# Altium project MotherBoard.PrjPcb (part 1 of 3)
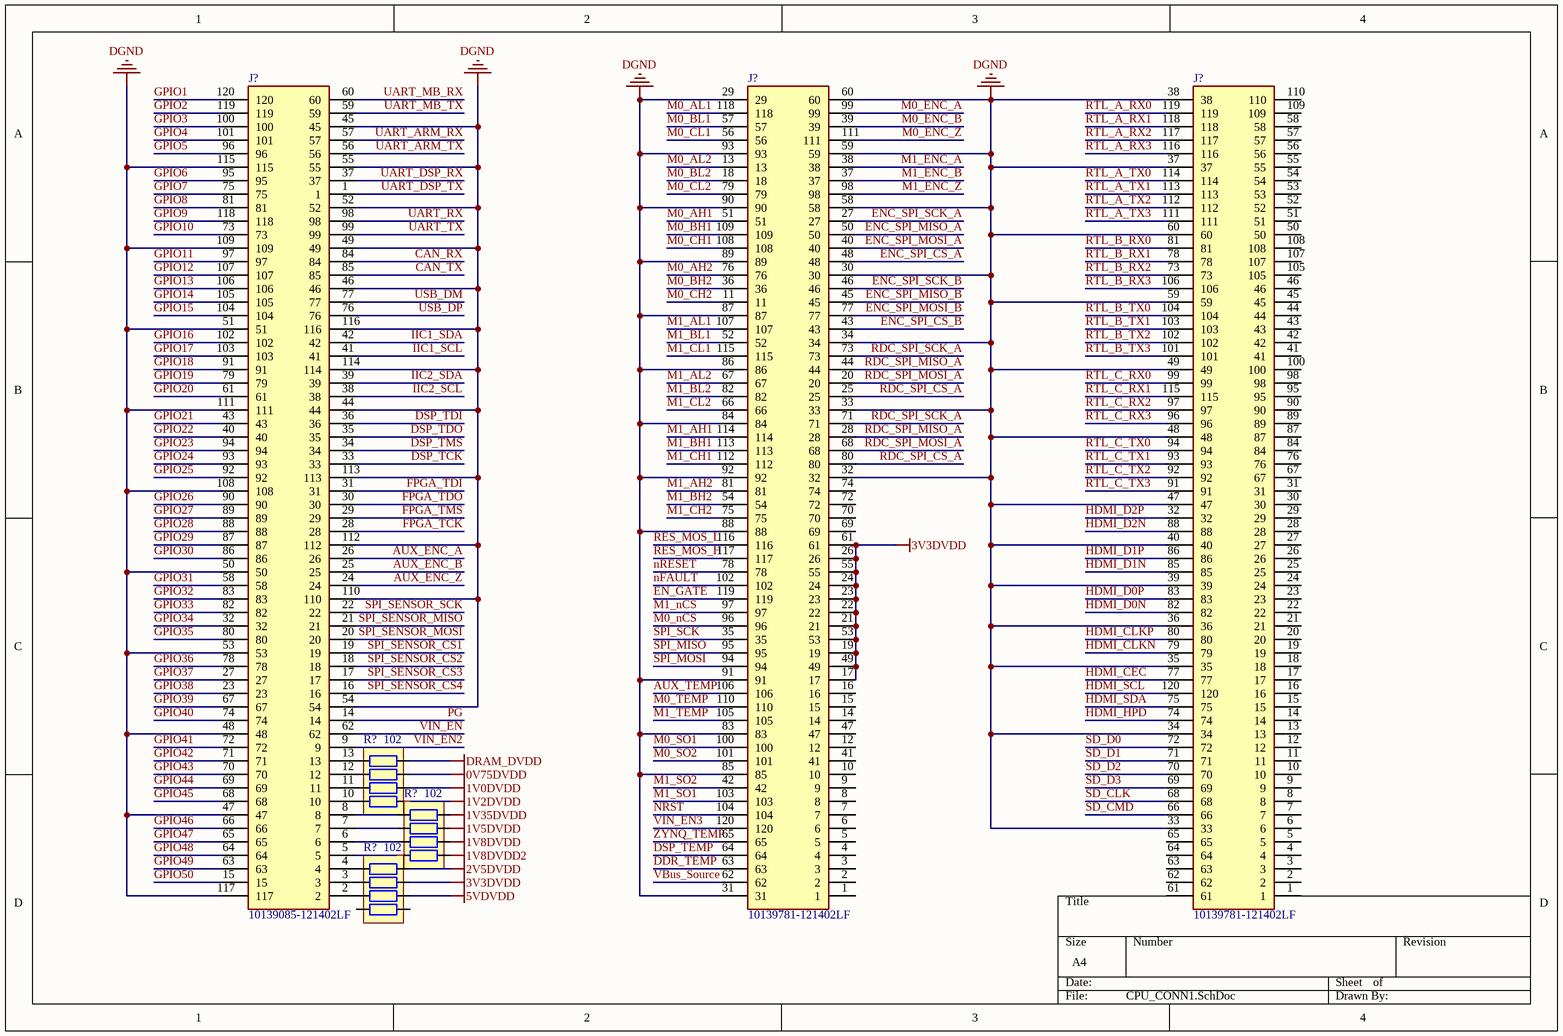
[diagram p0: CPU_CONN1.SchDoc]
15 sheets, 445 parts. Net scope: hierarchical (ports join the sheet entries above them; power ports are global).
Sheets:
  CPU_CONN1.SchDoc
  CPLD.SchDoc
  MainPower.SchDoc
  DigiConn.SchDoc
  PowerBRDConn.SchDoc
  RK3399PRO-JD4.SchDoc
    U_WIFI_BT = WIFI_BT.SchDoc
    U_CODEC = CODEC.SchDoc
    U_HDMI = HDMI.SchDoc
    U_EthernetRTL8211 = EthernetRTL8211.SchDoc
    U_USB_HUB = USB_HUB.SchDoc
    U_STM32F103 = STM32F103.SchDoc
      U_STM32F1Debugger = STM32F1Debugger.SchDoc
      U_PT100 = PT100.SchDoc
        U_PT100_SIG1 = PT100_SIG.SchDoc
        U_PT100_SIG2 = PT100_SIG.SchDoc
        U_PT100_SIG3 = PT100_SIG.SchDoc
        U_PT100_SIG4 = PT100_SIG.SchDoc

## Sheet CPU_CONN1.SchDoc
size A4; SheetNumber: 1; SheetTotal: 16

### Parts
(Parts that share a designator on the sheet are numbered #1, #2 ... from top to bottom, then left to right.)
J?#1  10139085-121402LF  [10139085121402LF]
J?#2  10139781-121402LF  [10139781121402LF]
J?#3  10139781-121402LF  [10139781121402LF]
R?#1  102  [RCA-8P4R-0603]
R?#2  102  [RCA-8P4R-0603]
R?#3  102  [RCA-8P4R-0603]

### Nets
0V75DVDD: R?#1.7
1V0DVDD: R?#1.6
1V2DVDD: R?#1.5
1V5DVDD: R?#2.7
1V8DVDD: R?#2.6
1V8DVDD2: R?#2.5
1V35DVDD: R?#2.8
2V5DVDD: R?#3.8
3V3DVDD: J?#2.17 J?#2.19 J?#2.21 J?#2.22 J?#2.23 J?#2.24 J?#2.26 J?#2.49 J?#2.53 J?#2.55 J?#2.61 R?#3.7
5VDVDD: R?#3.6
DGND: J?#1.44 J?#1.45 J?#1.46 J?#1.47 J?#1.48 J?#1.49 J?#1.50 J?#1.51 J?#1.52 J?#1.53 J?#1.54 J?#1.55 J?#1.108 J?#1.109 J?#1.110 J?#1.111 J?#1.112 J?#1.113 J?#1.114 J?#1.115 J?#1.116 J?#1.117 J?#2.29 J?#2.30 J?#2.31 J?#2.32 J?#2.33 J?#2.34 J?#2.58 J?#2.59 J?#2.60 J?#2.83 J?#2.84 J?#2.85 J?#2.86 J?#2.87 J?#2.88 J?#2.89 J?#2.90 J?#2.91 J?#2.92 J?#2.93 J?#3.33 J?#3.34 J?#3.35 J?#3.36 J?#3.37 J?#3.38 J?#3.39 J?#3.40 J?#3.47 J?#3.48 J?#3.49 J?#3.59 J?#3.60
DRAM_DVDD: R?#1.8
AUX_ENC_A: J?#1.26
AUX_ENC_B: J?#1.25
AUX_ENC_Z: J?#1.24
AUX_TEMP: J?#2.106
CAN_RX: J?#1.84
CAN_TX: J?#1.85
DDR_TEMP: J?#2.63
DSP_TCK: J?#1.33
DSP_TDI: J?#1.36
DSP_TDO: J?#1.35
DSP_TEMP: J?#2.64
DSP_TMS: J?#1.34
EN_GATE: J?#2.119
ENC_SPI_CS_A: J?#2.48
ENC_SPI_CS_B: J?#2.43
ENC_SPI_MISO_A: J?#2.50
ENC_SPI_MISO_B: J?#2.45
ENC_SPI_MOSI_A: J?#2.40
ENC_SPI_MOSI_B: J?#2.77
ENC_SPI_SCK_A: J?#2.27
ENC_SPI_SCK_B: J?#2.46
FPGA_TCK: J?#1.28
FPGA_TDI: J?#1.31
FPGA_TDO: J?#1.30
FPGA_TMS: J?#1.29
GPIO1: J?#1.120
GPIO2: J?#1.119
GPIO3: J?#1.100
GPIO4: J?#1.101
GPIO5: J?#1.96
GPIO6: J?#1.95
GPIO7: J?#1.75
GPIO8: J?#1.81
GPIO9: J?#1.118
GPIO10: J?#1.73
GPIO11: J?#1.97
GPIO12: J?#1.107
GPIO13: J?#1.106
GPIO14: J?#1.105
GPIO15: J?#1.104
GPIO16: J?#1.102
GPIO17: J?#1.103
GPIO18: J?#1.91
GPIO19: J?#1.79
GPIO20: J?#1.61
GPIO21: J?#1.43
GPIO22: J?#1.40
GPIO23: J?#1.94
GPIO24: J?#1.93
GPIO25: J?#1.92
GPIO26: J?#1.90
GPIO27: J?#1.89
GPIO28: J?#1.88
GPIO29: J?#1.87
GPIO30: J?#1.86
GPIO31: J?#1.58
GPIO32: J?#1.83
GPIO33: J?#1.82
GPIO34: J?#1.32
GPIO35: J?#1.80
GPIO36: J?#1.78
GPIO37: J?#1.27
GPIO38: J?#1.23
GPIO39: J?#1.67
GPIO40: J?#1.74
GPIO41: J?#1.72
GPIO42: J?#1.71
GPIO43: J?#1.70
GPIO44: J?#1.69
GPIO45: J?#1.68
GPIO46: J?#1.66
GPIO47: J?#1.65
GPIO48: J?#1.64
GPIO49: J?#1.63
GPIO50: J?#1.15
HDMI_CEC: J?#3.77
HDMI_CLKN: J?#3.79
HDMI_CLKP: J?#3.80
HDMI_D0N: J?#3.82
HDMI_D0P: J?#3.83
HDMI_D1N: J?#3.85
HDMI_D1P: J?#3.86
HDMI_D2N: J?#3.88
HDMI_D2P: J?#3.32
HDMI_HPD: J?#3.74
HDMI_SCL: J?#3.120
HDMI_SDA: J?#3.75
IIC1_SCL: J?#1.41
IIC1_SDA: J?#1.42
IIC2_SCL: J?#1.38
IIC2_SDA: J?#1.39
M0_AH1: J?#2.51
M0_AH2: J?#2.76
M0_AL1: J?#2.118
M0_AL2: J?#2.13
M0_BH1: J?#2.109
M0_BH2: J?#2.36
M0_BL1: J?#2.57
M0_BL2: J?#2.18
M0_CH1: J?#2.108
M0_CH2: J?#2.11
M0_CL1: J?#2.56
M0_CL2: J?#2.79
M0_ENC_A: J?#2.99
M0_ENC_B: J?#2.39
M0_ENC_Z: J?#2.111
M0_nCS: J?#2.96
M0_SO1: J?#2.100
M0_SO2: J?#2.101
M0_TEMP: J?#2.110
M1_AH1: J?#2.114
M1_AH2: J?#2.81
M1_AL1: J?#2.107
M1_AL2: J?#2.67
M1_BH1: J?#2.113
M1_BH2: J?#2.54
M1_BL1: J?#2.52
M1_BL2: J?#2.82
M1_CH1: J?#2.112
M1_CH2: J?#2.75
M1_CL1: J?#2.115
M1_CL2: J?#2.66
M1_ENC_A: J?#2.38
M1_ENC_B: J?#2.37
M1_ENC_Z: J?#2.98
M1_nCS: J?#2.97
M1_SO1: J?#2.103
M1_SO2: J?#2.42
M1_TEMP: J?#2.105
~{NRST}: J?#2.104
nFAULT: J?#2.102
nRESET: J?#2.78
PG: J?#1.14
RDC_SPI_CS_A: J?#2.25 J?#2.80
RDC_SPI_MISO_A: J?#2.28 J?#2.44
RDC_SPI_MOSI_A: J?#2.20 J?#2.68
RDC_SPI_SCK_A: J?#2.71 J?#2.73
RES_MOS_H: J?#2.117
RES_MOS_L: J?#2.116
RTL_A_RX0: J?#3.119
RTL_A_RX1: J?#3.118
RTL_A_RX2: J?#3.117
RTL_A_RX3: J?#3.116
RTL_A_TX0: J?#3.114
RTL_A_TX1: J?#3.113
RTL_A_TX2: J?#3.112
RTL_A_TX3: J?#3.111
RTL_B_RX0: J?#3.81
RTL_B_RX1: J?#3.78
RTL_B_RX2: J?#3.73
RTL_B_RX3: J?#3.106
RTL_B_TX0: J?#3.104
RTL_B_TX1: J?#3.103
RTL_B_TX2: J?#3.102
RTL_B_TX3: J?#3.101
RTL_C_RX0: J?#3.99
RTL_C_RX1: J?#3.115
RTL_C_RX2: J?#3.97
RTL_C_RX3: J?#3.96
RTL_C_TX0: J?#3.94
RTL_C_TX1: J?#3.93
RTL_C_TX2: J?#3.92
RTL_C_TX3: J?#3.91
SD_CLK: J?#3.68
SD_CMD: J?#3.66
SD_D0: J?#3.72
SD_D1: J?#3.71
SD_D2: J?#3.70
SD_D3: J?#3.69
SPI_MISO: J?#2.95
SPI_MOSI: J?#2.94
SPI_SCK: J?#2.35
SPI_SENSOR_CS1: J?#1.19
SPI_SENSOR_CS2: J?#1.18
SPI_SENSOR_CS3: J?#1.17
SPI_SENSOR_CS4: J?#1.16
SPI_SENSOR_MISO: J?#1.21
SPI_SENSOR_MOSI: J?#1.20
SPI_SENSOR_SCK: J?#1.22
UART_ARM_RX: J?#1.57
UART_ARM_TX: J?#1.56
UART_DSP_RX: J?#1.37
UART_DSP_TX: J?#1.1
UART_MB_RX: J?#1.60
UART_MB_TX: J?#1.59
UART_RX: J?#1.98
UART_TX: J?#1.99
USB_DM: J?#1.77
USB_DP: J?#1.76
VBus_Source: J?#2.62
VIN_EN: J?#1.62
VIN_EN2: J?#1.9
VIN_EN3: J?#2.120
ZYNQ_TEMP: J?#2.65
NetJ?#1_2: J?#1.2 R?#3.3
NetJ?#1_3: J?#1.3 R?#3.2
NetJ?#1_4: J?#1.4 R?#3.1
NetJ?#1_5: J?#1.5 R?#2.4
NetJ?#1_6: J?#1.6 R?#2.3
NetJ?#1_7: J?#1.7 R?#2.2
NetJ?#1_8: J?#1.8 R?#2.1
NetJ?#1_10: J?#1.10 R?#1.4
NetJ?#1_11: J?#1.11 R?#1.3
NetJ?#1_12: J?#1.12 R?#1.2
NetJ?#1_13: J?#1.13 R?#1.1

Not connected (* = marked no-connect by the designer): J?#2 1 2 3 4 5 6 7 8 9 10 12 14 15 16 41 47 69 70 72 74; J?#3 1 2 3 4 5 6 7 8 9 10 11 12 13 14 15 16 17 18 19 20 21 22 23 24 25 26 27 28 29 30 31 41 42 43 44 45 46 50 51 52 53 54 55 56 57 58 61 62 63 64 65 67 76 84 87 89 90 95 98 100 105 107 108 109 110; R?#3 4 5

### Library data of the parts
J?#1 = 10139085-121402LF: Connector FE; Manufacturer_Name: Amphenol Communications Solutions; Manufacturer_Part_Number: 10139781-121402LF; Datasheet Link: https://cdn.amphenol-cs.com/media/wysiwyg/files/drawing/10139781.pdf; Height: 4.3mm
J?#2 J?#3 = 10139781-121402LF: Connector M; Manufacturer_Name: Amphenol Communications Solutions; Datasheet Link: https://cdn.amphenol-cs.com/media/wysiwyg/files/drawing/10139781.pdf; Height: 4.3mm; Manufacturer_Part_Number: 10139781-121402LF
R?#1-R?#3 = R-8P4R: 贴片排阻; BOM名称: 贴片网络排阻; 版权归属: 封装库来自淘宝 ID：黄晶宝石; 联系售后: https://shop463601444.taobao.com

## Sheet CPLD.SchDoc
size A4; SheetNumber: 6; SheetTotal: 10
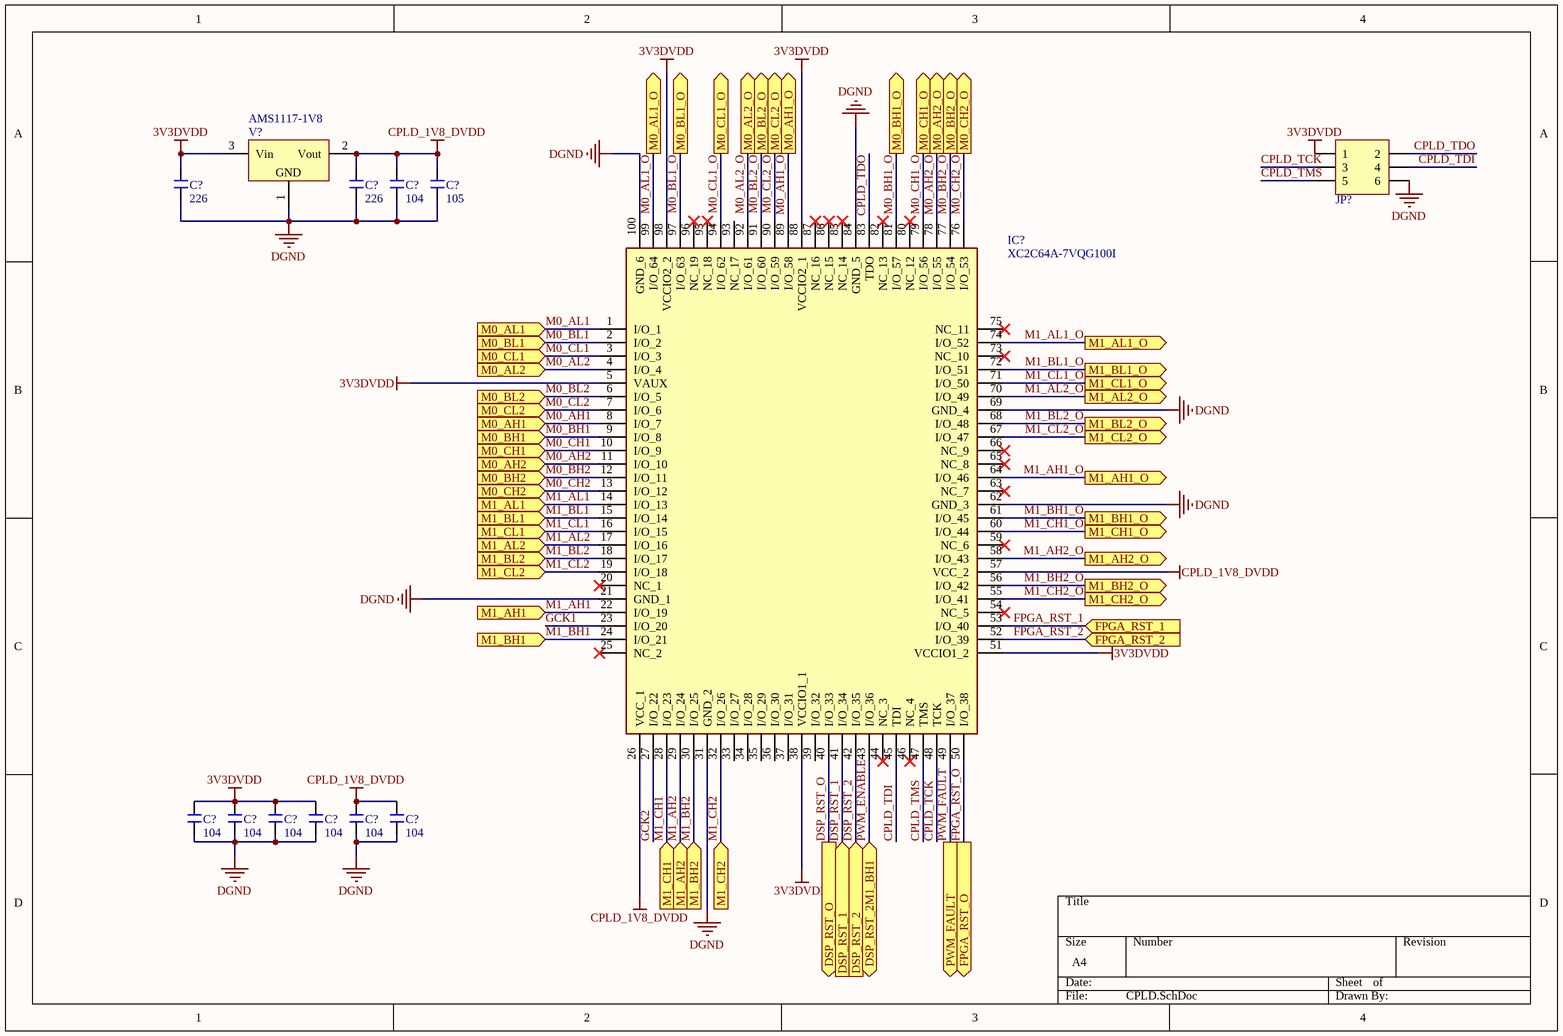
[diagram p1: CPLD.SchDoc]

### Parts
(Parts that share a designator on the sheet are numbered #1, #2 ... from top to bottom, then left to right.)
C?#1  226  [C 1206_L]
C?#2  226  [C 1206_L]
C?#3  104  [C 0603_L]
C?#4  105  [C 0603_L]
C?#5  104  [C 0603_L]
C?#6  104  [C 0603_L]
C?#7  104  [C 0603_L]
C?#8  104  [C 0603_L]
C?#9  104  [C 0603_L]
C?#10  104  [C 0603_L]
IC?#1  XC2C64A-7VQG100I  [QFP50P1600X1600X120-100N]
JP?#1  Header3X2  [IDC2.54-LI-2x3P]  (value not drawn)
V?  AMS1117-1V8  [SOT223_L]

### Ports
DSP_RST_1 (in), DSP_RST_2 (in), DSP_RST_2M1_BH1 (bidir), DSP_RST_O (out), FPGA_RST_1 (in), FPGA_RST_2 (in), FPGA_RST_O (out), M0_AH1 (in), M0_AH1_O (out), M0_AH2 (in), M0_AH2_O (out), M0_AL1 (in), M0_AL1_O (out), M0_AL2 (in), M0_AL2_O (out), M0_BH1 (in), M0_BH1_O (out), M0_BH2 (in), M0_BH2_O (out), M0_BL1 (in), M0_BL1_O (out), M0_BL2 (in), M0_BL2_O (out), M0_CH1 (in), M0_CH1_O (out), M0_CH2 (in), M0_CH2_O (out), M0_CL1 (in), M0_CL1_O (out), M0_CL2 (in), M0_CL2_O (out), M1_AH1 (in), M1_AH1_O (out), M1_AH2 (in), M1_AH2_O (out), M1_AL1 (in), M1_AL1_O (out), M1_AL2 (in), M1_AL2_O (out), M1_BH1 (in), M1_BH1_O (out), M1_BH2 (in), M1_BH2_O (out), M1_BL1 (in), M1_BL1_O (out), M1_BL2 (in), M1_BL2_O (out), M1_CH1 (in), M1_CH1_O (out), M1_CH2 (in), M1_CH2_O (out), M1_CL1 (in), M1_CL1_O (out), M1_CL2 (in), M1_CL2_O (out), PWM_FAULT (out)

### Nets
3V3DVDD: C?#1.2 C?#5.2 C?#6.2 C?#7.2 C?#8.2 IC?#1.5(VAUX) IC?#1.38(VCCIO1_1) IC?#1.51(VCCIO1_2) IC?#1.88(VCCIO2_1) IC?#1.98(VCCIO2_2) JP?#1.1 V?.3(Vin)
CPLD_1V8_DVDD: C?#2.2 C?#3.2 C?#4.2 C?#9.2 C?#10.2 IC?#1.26(VCC_1) IC?#1.57(VCC_2) V?.2(Vout)
DGND: C?#1.1 C?#2.1 C?#3.1 C?#4.1 C?#5.1 C?#6.1 C?#7.1 C?#8.1 C?#9.1 C?#10.1 IC?#1.21(GND_1) IC?#1.31(GND_2) IC?#1.62(GND_3) IC?#1.69(GND_4) IC?#1.84(GND_5) IC?#1.100(GND_6) JP?#1.6 V?.1(GND)
CPLD_TCK: IC?#1.48(TCK) JP?#1.3
CPLD_TDI: IC?#1.45(TDI) JP?#1.4
CPLD_TDO: IC?#1.83(TDO) JP?#1.2
CPLD_TMS: IC?#1.47(TMS) JP?#1.5
DSP_RST_1: IC?#1.41(I/O_34) ; port DSP_RST_1
DSP_RST_2: IC?#1.42(I/O_35) ; port DSP_RST_2
DSP_RST_O: IC?#1.40(I/O_33) ; port DSP_RST_O
FPGA_RST_1: IC?#1.53(I/O_40) ; port FPGA_RST_1
FPGA_RST_2: IC?#1.52(I/O_39) ; port FPGA_RST_2
FPGA_RST_O: IC?#1.50(I/O_38) ; port FPGA_RST_O
GCK1: IC?#1.23(I/O_20)
GCK2: IC?#1.27(I/O_22)
M0_AH1: IC?#1.8(I/O_7) ; port M0_AH1
M0_AH1_O: IC?#1.89(I/O_58) ; port M0_AH1_O
M0_AH2: IC?#1.11(I/O_10) ; port M0_AH2
M0_AH2_O: IC?#1.78(I/O_55) ; port M0_AH2_O
M0_AL1: IC?#1.1(I/O_1) ; port M0_AL1
M0_AL1_O: IC?#1.99(I/O_64) ; port M0_AL1_O
M0_AL2: IC?#1.4(I/O_4) ; port M0_AL2
M0_AL2_O: IC?#1.92(I/O_61) ; port M0_AL2_O
M0_BH1: IC?#1.9(I/O_8) ; port M0_BH1
M0_BH1_O: IC?#1.81(I/O_57) ; port M0_BH1_O
M0_BH2: IC?#1.12(I/O_11) ; port M0_BH2
M0_BH2_O: IC?#1.77(I/O_54) ; port M0_BH2_O
M0_BL1: IC?#1.2(I/O_2) ; port M0_BL1
M0_BL1_O: IC?#1.97(I/O_63) ; port M0_BL1_O
M0_BL2: IC?#1.6(I/O_5) ; port M0_BL2
M0_BL2_O: IC?#1.91(I/O_60) ; port M0_BL2_O
M0_CH1: IC?#1.10(I/O_9) ; port M0_CH1
M0_CH1_O: IC?#1.79(I/O_56) ; port M0_CH1_O
M0_CH2: IC?#1.13(I/O_12) ; port M0_CH2
M0_CH2_O: IC?#1.76(I/O_53) ; port M0_CH2_O
M0_CL1: IC?#1.3(I/O_3) ; port M0_CL1
M0_CL1_O: IC?#1.94(I/O_62) ; port M0_CL1_O
M0_CL2: IC?#1.7(I/O_6) ; port M0_CL2
M0_CL2_O: IC?#1.90(I/O_59) ; port M0_CL2_O
M1_AH1: IC?#1.22(I/O_19) ; port M1_AH1
M1_AH1_O: IC?#1.64(I/O_46) ; port M1_AH1_O
M1_AH2: IC?#1.29(I/O_24) ; port M1_AH2
M1_AH2_O: IC?#1.58(I/O_43) ; port M1_AH2_O
M1_AL1: IC?#1.14(I/O_13) ; port M1_AL1
M1_AL1_O: IC?#1.74(I/O_52) ; port M1_AL1_O
M1_AL2: IC?#1.17(I/O_16) ; port M1_AL2
M1_AL2_O: IC?#1.70(I/O_49) ; port M1_AL2_O
M1_BH1: IC?#1.24(I/O_21) ; port M1_BH1
M1_BH1_O: IC?#1.61(I/O_45) ; port M1_BH1_O
M1_BH2: IC?#1.30(I/O_25) ; port M1_BH2
M1_BH2_O: IC?#1.56(I/O_42) ; port M1_BH2_O
M1_BL1: IC?#1.15(I/O_14) ; port M1_BL1
M1_BL1_O: IC?#1.72(I/O_51) ; port M1_BL1_O
M1_BL2: IC?#1.18(I/O_17) ; port M1_BL2
M1_BL2_O: IC?#1.68(I/O_48) ; port M1_BL2_O
M1_CH1: IC?#1.28(I/O_23) ; port M1_CH1
M1_CH1_O: IC?#1.60(I/O_44) ; port M1_CH1_O
M1_CH2: IC?#1.32(I/O_26) ; port M1_CH2
M1_CH2_O: IC?#1.55(I/O_41) ; port M1_CH2_O
M1_CL1: IC?#1.16(I/O_15) ; port M1_CL1
M1_CL1_O: IC?#1.71(I/O_50) ; port M1_CL1_O
M1_CL2: IC?#1.19(I/O_18) ; port M1_CL2
M1_CL2_O: IC?#1.67(I/O_47) ; port M1_CL2_O
PWM_ENABLE: IC?#1.43(I/O_36) ; port DSP_RST_2M1_BH1
PWM_FAULT: IC?#1.49(I/O_37) ; port PWM_FAULT

Not connected (* = marked no-connect by the designer): IC?#1 20(NC_1)* 25(NC_2)* 33(I/O_27) 34(I/O_28) 35(I/O_29) 36(I/O_30) 37(I/O_31) 39(I/O_32) 44(NC_3)* 46(NC_4)* 54(NC_5)* 59(NC_6)* 63(NC_7)* 65(NC_8)* 66(NC_9)* 73(NC_10)* 75(NC_11)* 80(NC_12)* 82(NC_13)* 85(NC_14)* 86(NC_15)* 87(NC_16)* 93(NC_17) 95(NC_18)* 96(NC_19)*

### Library data of the parts
C?#1-C?#10 = C: 贴片电容; BOM名称: 无极性贴片电容
IC?#1 = XC2C64A-7VQG100I: Integrated Circuit; Manufacturer_Name: XILINX; Datasheet Link: https://docs.xilinx.com/v/u/en-US/ds311; Height: 1.2mm; Manufacturer_Part_Number: XC2C64A-7VQG100I; Mouser Part Number: 217-XC2C64A-7VQG100I; Mouser Price/Stock: https://www.mouser.co.uk/ProductDetail/Xilinx/XC2C64A-7VQG100I?qs=rrS6PyfT74c4zVdxhv%2F4jw%3D%3D
JP?#1 = Header 3X2: 3*2P接插件; 版权归属: 封装库来自淘宝 ID：黄晶宝石; BOM名称: 3*2P接插件; 学习资源: https://shop463601444.taobao.com
V? = AMS1117: 三端稳压芯片; BOM名称: 稳压芯片

## Sheet MainPower.SchDoc
size A4; SheetNumber: 7; SheetTotal: 16
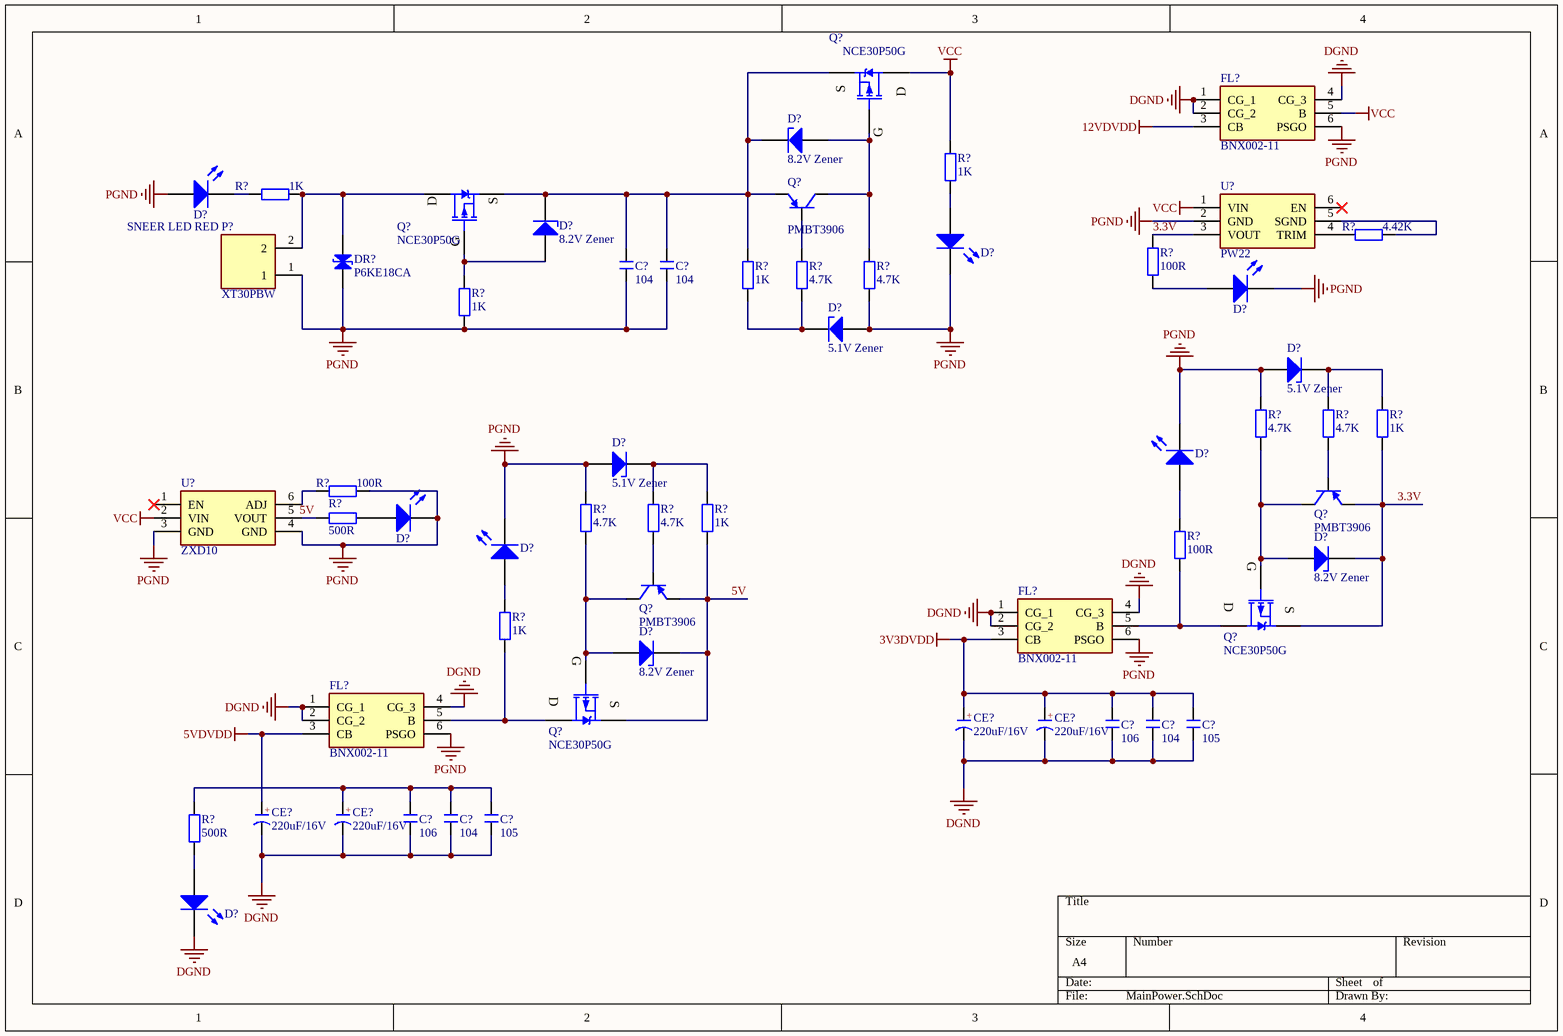
[diagram p2: MainPower.SchDoc]

### Parts
(Parts that share a designator on the sheet are numbered #1, #2 ... from top to bottom, then left to right.)
C?#11  104  [C 0603_L]
C?#12  104  [C 0603_L]
C?#13  106  [C 0603_L]
C?#14  104  [C 0603_L]
C?#15  105  [C 0603_L]
C?#16  106  [C 0603_L]
C?#17  104  [C 0603_L]
C?#18  105  [C 0603_L]
CE?#1  220uF/16V  [CAP 1.5*4*8]
CE?#2  220uF/16V  [CAP 1.5*4*8]
CE?#3  220uF/16V  [CAP 1.5*4*8]
CE?#4  220uF/16V  [CAP 1.5*4*8]
D?#1  8.2V Zener  [DIODE-1206]
D?#2  LED  [LED 0603W]  (value not drawn)
D?#3  8.2V Zener  [DIODE-1206]
D?#4  LED  [LED 0603W]  (value not drawn)
D?#5  LED  [LED 0603W]  (value not drawn)
D?#6  5.1V Zener  [DIODE-1206]
D?#7  5.1V Zener  [DIODE-1206]
D?#8  5.1V Zener  [DIODE-1206]
D?#9  LED  [LED 0603W]  (value not drawn)
D?#10  LED  [LED 0603W]  (value not drawn)
D?#11  LED  [LED 0603W]  (value not drawn)
D?#12  8.2V Zener  [DIODE-1206]
D?#13  8.2V Zener  [DIODE-1206]
D?#14  LED  [LED 0603W]  (value not drawn)
DR?  P6KE18CA  [SMA]
FL?#1  BNX002-11  [BNX00211]
FL?#2  BNX002-11  [BNX00211]
FL?#3  BNX002-11  [BNX00211]
P?  XT30PBW  [XT60]
Q?#1  NCE30P50G  [DFN 5X6]
Q?#2  PMBT3906  [SOT23-3N]
Q?#3  NCE30P50G  [DFN 5X6]
Q?#4  PMBT3906  [SOT23-3N]
Q?#5  NCE30P50G  [DFN 5X6]
Q?#6  PMBT3906  [SOT23-3N]
Q?#7  NCE30P50G  [DFN 5X6]
R?#4  1K  [R 0603_L]
R?#5  1K  [R 0603_L]
R?#6  100R  [R 0603_L]
R?#7  4.42K  [R 0603_L]
R?#8  1K  [R 0603_L]
R?#9  4.7K  [R 0603_L]
R?#10  4.7K  [R 0603_L]
R?#11  1K  [R 0603_L]
R?#12  4.7K  [R 0603_L]
R?#13  4.7K  [R 0603_L]
R?#14  1K  [R 0603_L]
R?#15  100R  [R 0603_L]
R?#16  4.7K  [R 0603_L]
R?#17  500R  [R 0603_L]
R?#18  4.7K  [R 0603_L]
R?#19  1K  [R 0603_L]
R?#20  100R  [R 0603_L]
R?#21  1K  [R 0603_L]
R?#22  500R  [R 0603_L]
U?#1  PW22  [PW22]
U?#2  ZXD10  [ZXD10]

### Nets
3V3DVDD: C?#13.2 C?#14.2 C?#15.2 CE?#1.1(A) CE?#2.1(A) FL?#2.3(CB)
5VDVDD: CE?#3.1(A) FL?#3.3(CB)
12VDVDD: FL?#1.3(CB)
DGND: C?#13.1 C?#14.1 C?#15.1 C?#16.1 C?#17.1 C?#18.1 CE?#1.2(K) CE?#2.2(K) CE?#3.2(K) CE?#4.2(K) D?#14.2(K) FL?#1.1(CG_1) FL?#1.2(CG_2) FL?#1.4(CG_3) FL?#2.1(CG_1) FL?#2.2(CG_2) FL?#2.4(CG_3) FL?#3.1(CG_1) FL?#3.2(CG_2) FL?#3.4(CG_3)
PGND: C?#11.1 C?#12.1 D?#2.1(A) D?#4.2(K) D?#5.2(K) D?#6.1(A) D?#7.1(A) D?#8.1(A) D?#9.2(K) D?#10.2(K) D?#11.2(K) DR?.1(A) FL?#1.6(PSGO) FL?#2.6(PSGO) FL?#3.6(PSGO) P?.1 R?#10.1 R?#11.1 R?#12.1 R?#15.1 R?#16.1 U?#1.2(GND) U?#2.3(GND) U?#2.4(GND)
VCC: FL?#1.5(B) Q?#1.2(D) R?#4.1 U?#1.1(VIN) U?#2.2(VIN)
3.3V: D?#12.2(K) Q?#4.2(E) Q?#5.3(S) R?#6.1 R?#14.1 U?#1.3(VOUT)
5V: D?#13.2(K) Q?#6.2(E) Q?#7.3(S) R?#17.1 R?#19.1 U?#2.5(VOUT)
NetC?#11_2: C?#11.2 C?#12.2 D?#1.2(K) D?#3.2(K) Q?#1.3(S) Q?#2.2(E) Q?#3.3(S) R?#8.1
NetC?#16_2: C?#16.2 C?#17.2 C?#18.2 CE?#4.1(A) R?#22.1
NetD?#1_1: D?#1.1(A) Q?#1.1(G) Q?#2.3(C) R?#10.2
NetD?#2_2: D?#2.2(K) R?#5.2
NetD?#3_1: D?#3.1(A) Q?#3.1(G) R?#11.2
NetD?#4_1: D?#4.1(A) R?#4.2
NetD?#5_1: D?#5.1(A) R?#6.2
NetD?#6_2: D?#6.2(K) R?#8.2 R?#9.2
NetD?#7_2: D?#7.2(K) R?#13.2 R?#14.2
NetD?#8_2: D?#8.2(K) R?#18.2 R?#19.2
NetD?#9_1: D?#9.1(A) R?#20.2
NetD?#10_1: D?#10.1(A) R?#17.2
NetD?#11_1: D?#11.1(A) R?#21.2
NetD?#12_1: D?#12.1(A) Q?#4.3(C) Q?#5.1(G) R?#12.2
NetD?#13_1: D?#13.1(A) Q?#6.3(C) Q?#7.1(G) R?#16.2
NetD?#14_1: D?#14.1(A) R?#22.2
NetDR?_2: DR?.2(K) P?.2 Q?#3.2(D) R?#5.1
NetFL?#2_5: FL?#2.5(B) Q?#5.2(D) R?#20.1
NetFL?#3_5: FL?#3.5(B) Q?#7.2(D) R?#21.1
NetQ?#2_1: Q?#2.1(B) R?#9.1
NetQ?#4_1: Q?#4.1(B) R?#13.1
NetQ?#6_1: Q?#6.1(B) R?#18.1
NetR?#7_1: R?#7.1 U?#1.5(SGND)
NetR?#7_2: R?#7.2 U?#1.4(TRIM)
NetR?#15_2: R?#15.2 U?#2.6(ADJ)

Not connected (* = marked no-connect by the designer): U?#1 6(EN)*; U?#2 1(EN)*

### Notes on the sheet
- (near D?#2) SNEER LED RED
- (in symbol CE) +

### Library data of the parts
C?#11-C?#18 = C: 贴片电容; BOM名称: 无极性贴片电容; 淘宝ID: 封装库来自淘宝 ID：黄晶宝石; 联系售后，技术支持: https://shop463601444.taobao.com; 唯一出售店铺网址: https://shop463601444.taobao.com
CE?#1-CE?#4 = CE: 直插电解电容; 淘宝ID: 封装库来自淘宝 ID：黄晶宝石; BOM名称: 直插电解电容; 联系售后: https://shop463601444.taobao.com
D?#1 D?#3 D?#6-D?#8 D?#12 D?#13 = 稳压二极管: Zener Diode
D?#2 D?#4 D?#5 D?#9-D?#11 D?#14 = LED: 发光二极管
  D?#2 D?#5 D?#9-D?#11 D?#14: 技术支持，联系售后: https://shop463601444.taobao.com
DR? = DR: 瞬态电压抑制二极管; 版权归属: 封装库来自淘宝 ID：黄晶宝石; BOM名称: 瞬态电压抑制二极管; 学习资源: https://shop463601444.taobao.com
FL?#1-FL?#3 = BNX002-11: Filter; Manufacturer_Name: Murata Electronics; Datasheet Link: https://componentsearchengine.com//BNX002-11.pdf; Height: 12.5mm; Mouser2 Part Number: 81-BNX002-11; Mouser2 Price/Stock: https://www.mouser.com/Search/Refine.aspx?Keyword=81-BNX002-11; Manufacturer_Part_Number: BNX002-11
P? = XT60PBW
Q?#1 Q?#3 Q?#5 Q?#7 = IRF4905: P沟场效应管; BOM名称: P沟场效应管
Q?#2 Q?#4 Q?#6 = 8550-SMD: 高频放大-PNP型; 属性: 40V 1.5A 1W 100MHZ
R?#4-R?#22 = R: 贴片电阻

## Sheet DigiConn.SchDoc
size A4; SheetNumber: 11; SheetTotal: 11
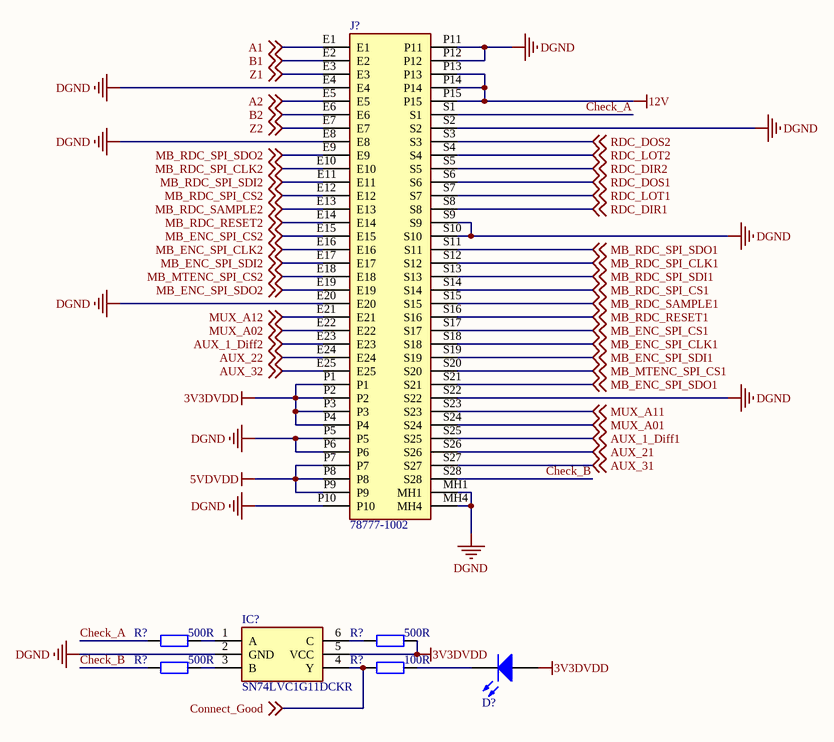
[diagram p3: DigiConn.SchDoc]

### Parts
(Parts that share a designator on the sheet are numbered #1, #2 ... from top to bottom, then left to right.)
D?#15  LED  [LED_A2]  (value not drawn)
IC?#2  SN74LVC1G11DCKR  [SOT65P210X110-6N]
J?#4  78777-1002  [787771002]
R?#23  500R  [R 0603_L]
R?#24  500R  [R 0603_L]
R?#25  500R  [R 0603_L]
R?#26  100R  [R 0603_L]

### Nets
3V3DVDD: D?#15.1(A) IC?#2.5(VCC) J?#4.P1 J?#4.P2 J?#4.P3 J?#4.P4 R?#24.1
5VDVDD: J?#4.P7 J?#4.P8 J?#4.P9
12V: J?#4.P13 J?#4.P14 J?#4.P15
DGND: IC?#2.2(GND) J?#4.E4 J?#4.E8 J?#4.E20 J?#4.MH1 J?#4.MH4 J?#4.P5 J?#4.P6 J?#4.P10 J?#4.P11 J?#4.P12 J?#4.S2 J?#4.S9 J?#4.S10 J?#4.S22
A1: J?#4.E1 ; off-sheet A1
A2: J?#4.E5 ; off-sheet A2
AUX_1_Diff1: J?#4.S25 ; off-sheet AUX_1_Diff1
AUX_1_Diff2: J?#4.E23 ; off-sheet AUX_1_Diff2
AUX_21: J?#4.S26 ; off-sheet AUX_21
AUX_22: J?#4.E24 ; off-sheet AUX_22
AUX_31: J?#4.S27 ; off-sheet AUX_31
AUX_32: J?#4.E25 ; off-sheet AUX_32
B1: J?#4.E2 ; off-sheet B1
B2: J?#4.E6 ; off-sheet B2
Check_A: J?#4.S1 R?#23.2
Check_B: J?#4.S28 R?#25.2
Connect_Good: IC?#2.4(Y) R?#26.2 ; off-sheet Connect_Good
MB_ENC_SPI_CLK1: J?#4.S18 ; off-sheet MB_ENC_SPI_CLK1
MB_ENC_SPI_CLK2: J?#4.E16 ; off-sheet MB_ENC_SPI_CLK2
MB_ENC_SPI_CS1: J?#4.S17 ; off-sheet MB_ENC_SPI_CS1
MB_ENC_SPI_CS2: J?#4.E15 ; off-sheet MB_ENC_SPI_CS2
MB_ENC_SPI_SDI1: J?#4.S19 ; off-sheet MB_ENC_SPI_SDI1
MB_ENC_SPI_SDI2: J?#4.E17 ; off-sheet MB_ENC_SPI_SDI2
MB_ENC_SPI_SDO1: J?#4.S21 ; off-sheet MB_ENC_SPI_SDO1
MB_ENC_SPI_SDO2: J?#4.E19 ; off-sheet MB_ENC_SPI_SDO2
MB_MTENC_SPI_CS1: J?#4.S20 ; off-sheet MB_MTENC_SPI_CS1
MB_MTENC_SPI_CS2: J?#4.E18 ; off-sheet MB_MTENC_SPI_CS2
MB_RDC_RESET1: J?#4.S16 ; off-sheet MB_RDC_RESET1
MB_RDC_RESET2: J?#4.E14 ; off-sheet MB_RDC_RESET2
MB_RDC_SAMPLE1: J?#4.S15 ; off-sheet MB_RDC_SAMPLE1
MB_RDC_SAMPLE2: J?#4.E13 ; off-sheet MB_RDC_SAMPLE2
MB_RDC_SPI_CLK1: J?#4.S12 ; off-sheet MB_RDC_SPI_CLK1
MB_RDC_SPI_CLK2: J?#4.E10 ; off-sheet MB_RDC_SPI_CLK2
MB_RDC_SPI_CS1: J?#4.S14 ; off-sheet MB_RDC_SPI_CS1
MB_RDC_SPI_CS2: J?#4.E12 ; off-sheet MB_RDC_SPI_CS2
MB_RDC_SPI_SDI1: J?#4.S13 ; off-sheet MB_RDC_SPI_SDI1
MB_RDC_SPI_SDI2: J?#4.E11 ; off-sheet MB_RDC_SPI_SDI2
MB_RDC_SPI_SDO1: J?#4.S11 ; off-sheet MB_RDC_SPI_SDO1
MB_RDC_SPI_SDO2: J?#4.E9 ; off-sheet MB_RDC_SPI_SDO2
MUX_A01: J?#4.S24 ; off-sheet MUX_A01
MUX_A02: J?#4.E22 ; off-sheet MUX_A02
MUX_A11: J?#4.S23 ; off-sheet MUX_A11
MUX_A12: J?#4.E21 ; off-sheet MUX_A12
RDC_DIR1: J?#4.S8 ; off-sheet RDC_DIR1
RDC_DIR2: J?#4.S5 ; off-sheet RDC_DIR2
RDC_DOS1: J?#4.S6 ; off-sheet RDC_DOS1
RDC_DOS2: J?#4.S3 ; off-sheet RDC_DOS2
RDC_LOT1: J?#4.S7 ; off-sheet RDC_LOT1
RDC_LOT2: J?#4.S4 ; off-sheet RDC_LOT2
Z1: J?#4.E3 ; off-sheet Z1
Z2: J?#4.E7 ; off-sheet Z2
NetD?#15_2: D?#15.2(K) R?#26.1
NetIC?#2_1: IC?#2.1(A) R?#23.1
NetIC?#2_3: IC?#2.3(B) R?#25.1
NetIC?#2_6: IC?#2.6(C) R?#24.2

### Library data of the parts
D?#15 = LED: 发光二极管; 技术支持，联系售后: https://shop463601444.taobao.com
IC?#2 = SN74LVC1G11DCKR: Integrated Circuit; Manufacturer_Name: Texas Instruments; Datasheet Link: http://componentsearchengine.com/Datasheets/1/SN74LVC1G11DCKR.pdf; Height: 1.1mm; Manufacturer_Part_Number: SN74LVC1G11DCKR; Mouser Part Number: 595-SN74LVC1G11DCKR; Mouser Price/Stock: https://www.mouser.co.uk/ProductDetail/Texas-Instruments/SN74LVC1G11DCKR?qs=nqigI8dpoHIKzrNU0QT3Ag%3D%3D; Arrow Part Number: SN74LVC1G11DCKR; Arrow Price/Stock: https://www.arrow.com/en/products/sn74lvc1g11dckr/texas-instruments?region=nac
J?#4 = 78777-1002: Connector; Manufacturer_Name: Molex; Datasheet Link: https://www.molex.com/pdm_docs/sd/787771002_sd.pdf; Height: 10.03mm; Manufacturer_Part_Number: 78777-1002; Mouser Part Number: 538-78777-1002; Mouser Price/Stock: https://www.mouser.co.uk/ProductDetail/Molex/78777-1002?qs=PQDAUpz3sUPC2Og%2FkFefJw%3D%3D
R?#23-R?#26 = R: 贴片电阻; 版权归属: 来自淘宝 ID：黄晶宝石; 封装库来自淘宝卖家 ID：黄晶宝石: 其他店铺购入均为盗版，不享受售后技术支持服务，请立即申请退款; BOM名称: 贴片电阻; 联系售后: https://shop463601444.taobao.com

## Sheet PowerBRDConn.SchDoc
size A4; SheetNumber: 10; SheetTotal: 10
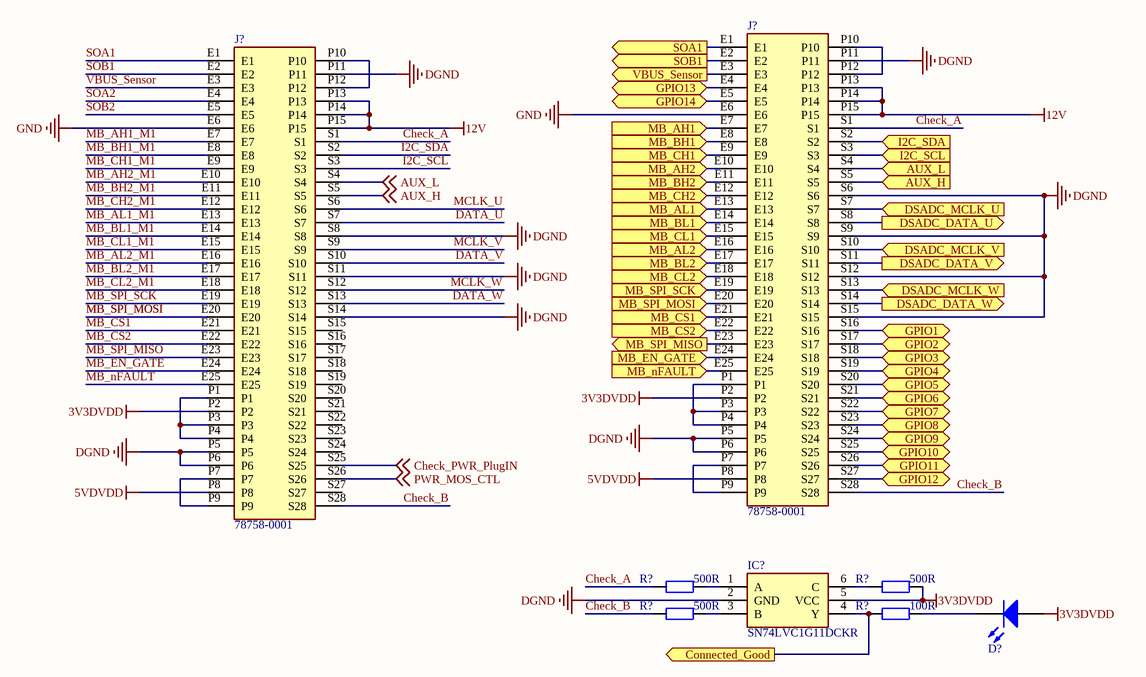
[diagram p4: PowerBRDConn.SchDoc]

### Parts
(Parts that share a designator on the sheet are numbered #1, #2 ... from top to bottom, then left to right.)
D?#16  LED  [LED_A2]  (value not drawn)
IC?#3  SN74LVC1G11DCKR  [SOT65P210X110-6N]
J?#5  78758-0001  [78758-0001]
J?#6  78758-0001  [78758-0001]
R?#27  500R  [R 0603_L]
R?#28  500R  [R 0603_L]
R?#29  500R  [R 0603_L]
R?#30  100R  [R 0603_L]

### Ports
AUX_H (in), AUX_L (in), Connected_Good (out), DSADC_DATA_U (out), DSADC_DATA_V (out), DSADC_DATA_W (out), DSADC_MCLK_U (in), DSADC_MCLK_V (in), DSADC_MCLK_W (in), GPIO1 (bidir), GPIO2 (bidir), GPIO3 (bidir), GPIO4 (bidir), GPIO5 (bidir), GPIO6 (bidir), GPIO7 (bidir), GPIO8 (bidir), GPIO9 (bidir), GPIO10 (bidir), GPIO11 (bidir), GPIO12 (bidir), GPIO13 (bidir), GPIO14 (bidir), I2C_SCL (in), I2C_SDA (in), MB_AH1 (in), MB_AH2 (in), MB_AL1 (in), MB_AL2 (in), MB_BH1 (in), MB_BH2 (in), MB_BL1 (in), MB_BL2 (in), MB_CH1 (in), MB_CH2 (in), MB_CL1 (in), MB_CL2 (in), MB_CS1 (in), MB_CS2 (in), MB_EN_GATE (in), MB_nFAULT (in), MB_SPI_MISO (out), MB_SPI_MOSI (in), MB_SPI_SCK (in), SOA1 (out), SOB1 (out), VBUS_Sensor (out)

### Nets
3V3DVDD: D?#16.1(A) IC?#3.5(VCC) J?#5.P2 J?#6.P2 R?#28.1
5VDVDD: J?#5.P8 J?#6.P8
12V: J?#5.P13 J?#5.P14 J?#5.P15 J?#6.P13 J?#6.P14 J?#6.P15
DGND: IC?#3.2(GND) J?#5.P5 J?#5.P6 J?#5.P11 J?#5.S6 J?#5.S9 J?#5.S12 J?#5.S15 J?#6.P5 J?#6.P6 J?#6.P11 J?#6.S8 J?#6.S11 J?#6.S14
GND: J?#5.E6 J?#6.E6
AUX_H: J?#6.S5 ; off-sheet AUX_H
AUX_L: J?#6.S4 ; off-sheet AUX_L
Check_A: J?#5.S1 J?#6.S1 R?#27.2
Check_B: J?#5.S28 J?#6.S28 R?#29.2
Check_PWR_PlugIN: J?#6.S25 ; off-sheet Check_PWR_PlugIN
DATA_U: J?#6.S7
DATA_V: J?#6.S10
DATA_W: J?#6.S13
I2C_SCL: J?#6.S3
I2C_SDA: J?#6.S2
MB_AH1_M1: J?#6.E7
MB_AH2_M1: J?#6.E10
MB_AL1_M1: J?#6.E13
MB_AL2_M1: J?#6.E16
MB_BH1_M1: J?#6.E8
MB_BH2_M1: J?#6.E11
MB_BL1_M1: J?#6.E14
MB_BL2_M1: J?#6.E17
MB_CH1_M1: J?#6.E9
MB_CH2_M1: J?#6.E12
MB_CL1_M1: J?#6.E15
MB_CL2_M1: J?#6.E18
MB_CS1: J?#6.E21
MB_CS2: J?#6.E22
MB_EN_GATE: J?#6.E24
MB_nFAULT: J?#6.E25
MB_SPI_MISO: J?#6.E23
MB_SPI_MOSI: J?#6.E20
MB_SPI_SCK: J?#6.E19
MCLK_U: J?#6.S6
MCLK_V: J?#6.S9
MCLK_W: J?#6.S12
PWR_MOS_CTL: J?#6.S26 ; off-sheet PWR_MOS_CTL
SOA1: J?#6.E1
SOA2: J?#6.E4
SOB1: J?#6.E2
SOB2: J?#6.E5
VBUS_Sensor: J?#6.E3
NetD?#16_2: D?#16.2(K) R?#30.1
NetIC?#3_1: IC?#3.1(A) R?#27.1
NetIC?#3_3: IC?#3.3(B) R?#29.1
NetIC?#3_4: IC?#3.4(Y) R?#30.2 ; port Connected_Good
NetIC?#3_6: IC?#3.6(C) R?#28.2
NetJ?#5_E1: J?#5.E1 ; port SOA1
NetJ?#5_E2: J?#5.E2 ; port SOB1
NetJ?#5_E3: J?#5.E3 ; port VBUS_Sensor
NetJ?#5_E4: J?#5.E4 ; port GPIO13
NetJ?#5_E5: J?#5.E5 ; port GPIO14
NetJ?#5_E7: J?#5.E7 ; port MB_AH1
NetJ?#5_E8: J?#5.E8 ; port MB_BH1
NetJ?#5_E9: J?#5.E9 ; port MB_CH1
NetJ?#5_E10: J?#5.E10 ; port MB_AH2
NetJ?#5_E11: J?#5.E11 ; port MB_BH2
NetJ?#5_E12: J?#5.E12 ; port MB_CH2
NetJ?#5_E13: J?#5.E13 ; port MB_AL1
NetJ?#5_E14: J?#5.E14 ; port MB_BL1
NetJ?#5_E15: J?#5.E15 ; port MB_CL1
NetJ?#5_E16: J?#5.E16 ; port MB_AL2
NetJ?#5_E17: J?#5.E17 ; port MB_BL2
NetJ?#5_E18: J?#5.E18 ; port MB_CL2
NetJ?#5_E19: J?#5.E19 ; port MB_SPI_SCK
NetJ?#5_E20: J?#5.E20 ; port MB_SPI_MOSI
NetJ?#5_E21: J?#5.E21 ; port MB_CS1
NetJ?#5_E22: J?#5.E22 ; port MB_CS2
NetJ?#5_E23: J?#5.E23 ; port MB_SPI_MISO
NetJ?#5_E24: J?#5.E24 ; port MB_EN_GATE
NetJ?#5_E25: J?#5.E25 ; port MB_nFAULT
NetJ?#5_P1: J?#5.P1 J?#5.P3 J?#5.P4
NetJ?#5_P7: J?#5.P7 J?#5.P9
NetJ?#5_P10: J?#5.P10 J?#5.P12
NetJ?#5_S2: J?#5.S2 ; port I2C_SDA
NetJ?#5_S3: J?#5.S3 ; port I2C_SCL
NetJ?#5_S4: J?#5.S4 ; port AUX_L
NetJ?#5_S5: J?#5.S5 ; port AUX_H
NetJ?#5_S7: J?#5.S7 ; port DSADC_MCLK_U
NetJ?#5_S8: J?#5.S8 ; port DSADC_DATA_U
NetJ?#5_S10: J?#5.S10 ; port DSADC_MCLK_V
NetJ?#5_S11: J?#5.S11 ; port DSADC_DATA_V
NetJ?#5_S13: J?#5.S13 ; port DSADC_MCLK_W
NetJ?#5_S14: J?#5.S14 ; port DSADC_DATA_W
NetJ?#5_S16: J?#5.S16 ; port GPIO1
NetJ?#5_S17: J?#5.S17 ; port GPIO2
NetJ?#5_S18: J?#5.S18 ; port GPIO3
NetJ?#5_S19: J?#5.S19 ; port GPIO4
NetJ?#5_S20: J?#5.S20 ; port GPIO5
NetJ?#5_S21: J?#5.S21 ; port GPIO6
NetJ?#5_S22: J?#5.S22 ; port GPIO7
NetJ?#5_S23: J?#5.S23 ; port GPIO8
NetJ?#5_S24: J?#5.S24 ; port GPIO9
NetJ?#5_S25: J?#5.S25 ; port GPIO10
NetJ?#5_S26: J?#5.S26 ; port GPIO11
NetJ?#5_S27: J?#5.S27 ; port GPIO12
NetJ?#6_P1: J?#6.P1 J?#6.P3 J?#6.P4
NetJ?#6_P7: J?#6.P7 J?#6.P9
NetJ?#6_P10: J?#6.P10 J?#6.P12

Not connected (* = marked no-connect by the designer): J?#6 S15 S16 S17 S18 S19 S20 S21 S22 S23 S24 S27

### Library data of the parts
D?#16 = LED: 发光二极管; 技术支持，联系售后: https://shop463601444.taobao.com
IC?#3 = SN74LVC1G11DCKR: as IC?#2 on sheet DigiConn; Datasheet Link: http://componentsearchengine.com/Datasheets/1/SN74LVC1G11DCKR.pdf; Height: 1.1mm; Manufacturer_Part_Number: SN74LVC1G11DCKR; Mouser Part Number: 595-SN74LVC1G11DCKR; Mouser Price/Stock: https://www.mouser.co.uk/ProductDetail/Texas-Instruments/SN74LVC1G11DCKR?qs=nqigI8dpoHIKzrNU0QT3Ag%3D%3D; Arrow Part Number: SN74LVC1G11DCKR; Arrow Price/Stock: https://www.arrow.com/en/products/sn74lvc1g11dckr/texas-instruments?region=nac
J?#5 J?#6 = 78758-0001: Connector; Manufacturer_Name: Molex; Manufacturer_Part_Number: 78758-0001; Mouser Part Number: 538-78758-0001; Mouser Price/Stock: https://www.mouser.co.uk/ProductDetail/Molex/78758-0001?qs=wOSGPAwRNAFEK7d2ROR5rw%3D%3D
R?#27-R?#30 = R: as R?#23 on sheet DigiConn; BOM名称: 贴片电阻; 联系售后: https://shop463601444.taobao.com

## Sheet RK3399PRO-JD4.SchDoc
size A2; SheetNumber: 7; SheetTotal: 16
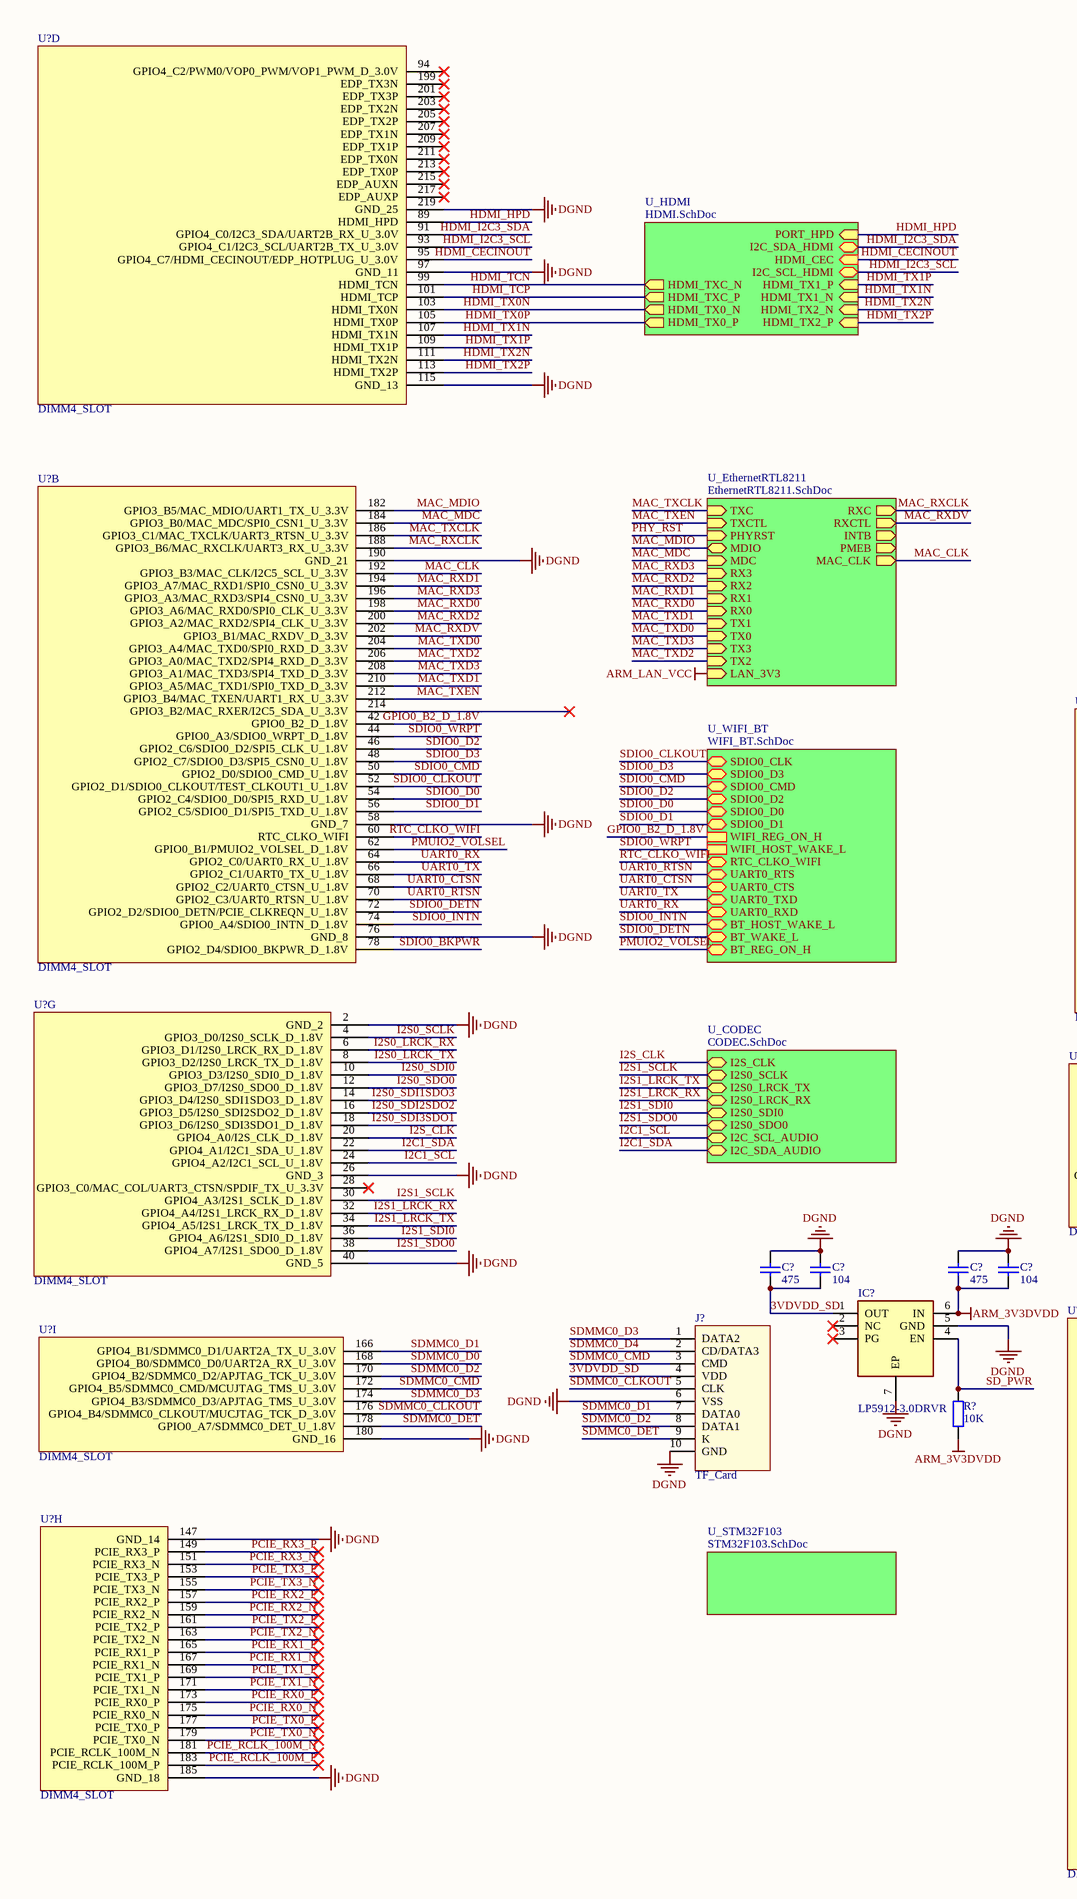
[diagram p5: RK3399PRO-JD4.SchDoc, left]
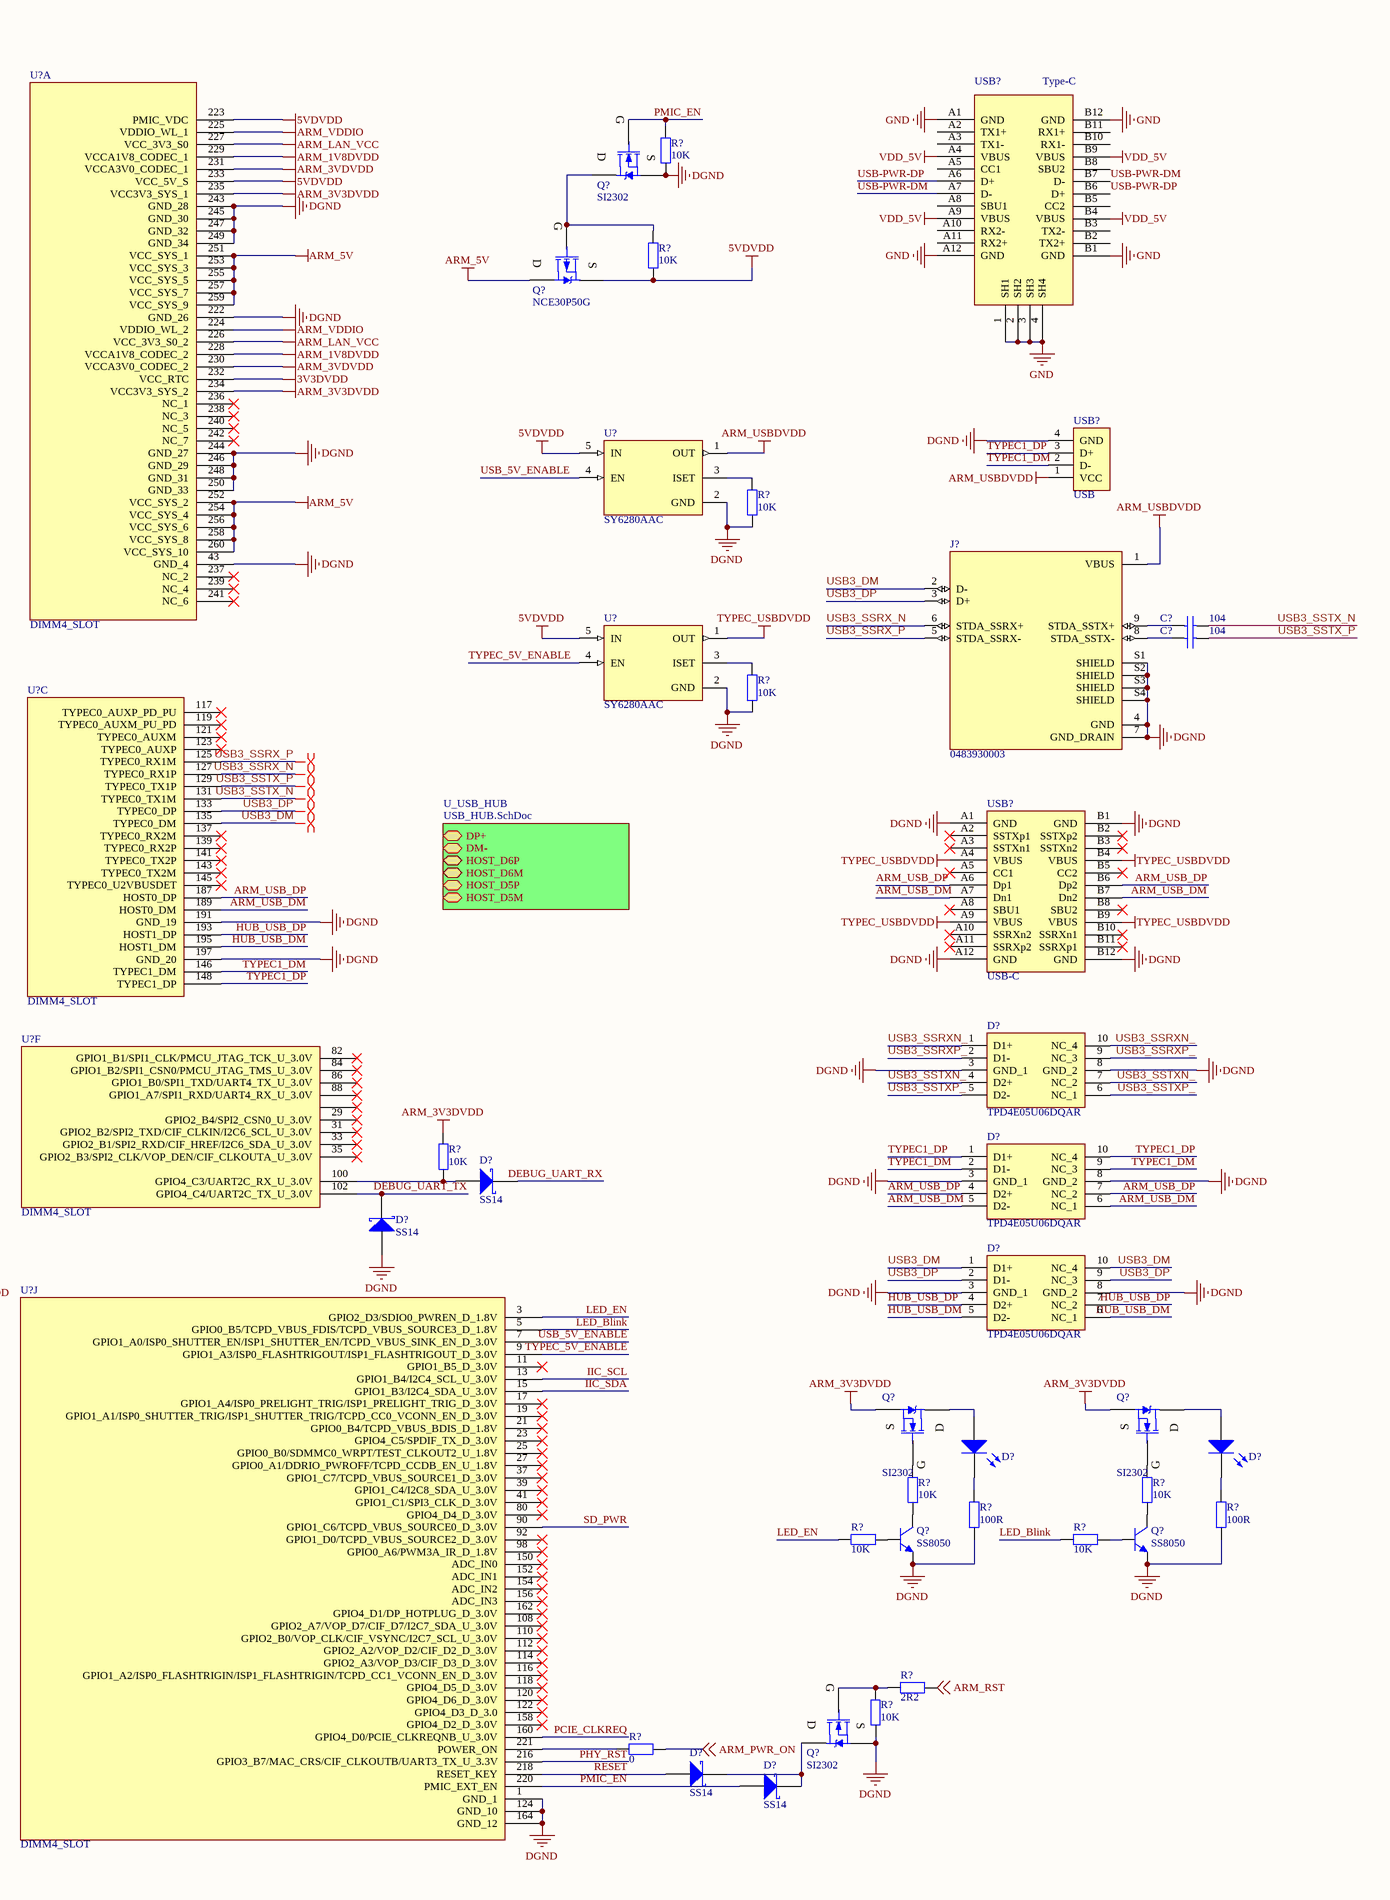
[diagram p6: RK3399PRO-JD4.SchDoc, right]

### Parts
(Parts that share a designator on the sheet are numbered #1, #2 ... from top to bottom, then left to right.)
C?#19  104  [C 0603_L]
C?#20  104  [C 0603_L]
C?#21  475  [C 0603_L]
C?#22  104  [C 0603_L]
C?#23  475  [C 0603_L]
C?#24  104  [C 0603_L]
D?#17  TPD4E05U06DQAR  [DQA(R-PUSON-N10)]
D?#18  TPD4E05U06DQAR  [DQA(R-PUSON-N10)]
D?#19  SS14  [SOD-323]
D?#20  SS14  [SOD-323]
D?#21  TPD4E05U06DQAR  [DQA(R-PUSON-N10)]
D?#22  LED  [LED_A1]  (value not drawn)
D?#23  LED  [LED_A1]  (value not drawn)
D?#24  SS14  [SOD-323]
D?#25  SS14  [SOD-323]
IC?#4  LP5912-3.0DRVR  [SON65P200X200X80-7N]
J?#7  0483930003  [MOLEX_0483930003]
J?#8  TF_Card  [Micro SD]
Q?#8  SI2302  [SOT23-3N]
Q?#9  NCE30P50G  [DFN 5X6]
Q?#10  SI2302  [SOT23-3N]
Q?#11  SI2302  [SOT23-3N]
Q?#12  SS8050  [SOT23-3N]
Q?#13  SS8050  [SOT23-3N]
Q?#14  SI2302  [SOT23-3N]
R?#31  10K  [R 0603_L]
R?#32  10K  [R 0603_L]
R?#33  10K  [R 0603_L]
R?#34  10K  [R 0603_L]
R?#35  10K  [R 0603_L]
R?#36  10K  [R 0603_L]
R?#37  10K  [R 0603_L]
R?#38  10K  [R 0603_L]
R?#39  100R  [R 0603_L]
R?#40  100R  [R 0603_L]
R?#41  10K  [R 0603_L]
R?#42  10K  [R 0603_L]
R?#43  2R2  [R 0603_L]
R?#44  10K  [R 0603_L]
R?#45  0  [R 0603_L]
U?#3  DIMM4_SLOT  (part D of 10)
U?#4  SY6280AAC  [SOT95P285X130-5N]
U?#5  DIMM4_SLOT  (part A of 10)
U?#6  SY6280AAC  [SOT95P285X130-5N]
U?#7  DIMM4_SLOT  (part B of 10)
U?#8  DIMM4_SLOT  (part C of 10)
U?#9  DIMM4_SLOT  (part F of 10)
U?#10  DIMM4_SLOT  (part G of 10)
U?#11  DIMM4_SLOT  (part I of 10)
U?#12  DIMM4_SLOT  (part H of 10)
U?#13  DIMM4_SLOT  (part J of 10)
USB?#1  Type-C  [Type-C-TOP]
USB?#2  USB  [USB_A/P_A]
USB?#3  USB-C  [USB-C/S_A]

### Sub-sheets
U_CODEC = CODEC.SchDoc: I2S_CLK (bidir), I2S0_SCLK (bidir), I2S0_LRCK_TX (bidir), I2S0_LRCK_RX (bidir), I2S0_SDI0 (bidir), I2S0_SDO0 (bidir), I2C_SCL_AUDIO (bidir), I2C_SDA_AUDIO (bidir)
U_EthernetRTL8211 = EthernetRTL8211.SchDoc: RXC (out), TXC (in), RXCTL (out), INTB (out), TXCTL (in), PHYRST (in), MDIO (bidir), MDC (in), PMEB (out), RX3 (in), RX2 (in), RX1 (in), RX0 (in), TX1 (in), TX0 (in), TX3 (in), TX2 (in), MAC_CLK (out), LAN_3V3 (in)
U_HDMI = HDMI.SchDoc: HDMI_TX2_P (in), HDMI_TX2_N (in), HDMI_TX1_N (in), HDMI_TX1_P (in), HDMI_TX0_P (out), HDMI_TX0_N (out), HDMI_TXC_P (out), HDMI_TXC_N (out), I2C_SCL_HDMI (bidir), HDMI_CEC (in), I2C_SDA_HDMI (bidir), PORT_HPD (in)
U_STM32F103 = STM32F103.SchDoc: no entries
U_USB_HUB = USB_HUB.SchDoc: DP+ (bidir), DM- (bidir), HOST_D6P (bidir), HOST_D6M (bidir), HOST_D5P (bidir), HOST_D5M (bidir)
U_WIFI_BT = WIFI_BT.SchDoc: SDIO0_CLK (bidir), SDIO0_D3 (bidir), SDIO0_CMD (bidir), SDIO0_D2 (bidir), SDIO0_D0 (bidir), SDIO0_D1 (bidir), WIFI_REG_ON_H, WIFI_HOST_WAKE_L, RTC_CLKO_WIFI (bidir), UART0_RTS (bidir), UART0_CTS (bidir), UART0_TXD (bidir), UART0_RXD (bidir), BT_HOST_WAKE_L (bidir), BT_WAKE_L (bidir), BT_REG_ON_H (bidir)

### Nets
3V3DVDD: U?#5.232(VCC_RTC)
5VDVDD: Q?#9.3(S) R?#32.1 U?#4.5(IN) U?#5.223(PMIC_VDC) U?#5.233(VCC_5V_S) U?#6.5(IN)
ARM_1V8DVDD: U?#5.228(VCCA1V8_CODEC_2) U?#5.229(VCCA1V8_CODEC_1)
ARM_3V3DVDD: C?#23.1 C?#24.1 IC?#4.6(IN) Q?#10.2(S) Q?#11.2(S) R?#35.2 R?#36.1 U?#5.234(VCC3V3_SYS_2) U?#5.235(VCC3V3_SYS_1)
ARM_3VDVDD: U?#5.230(VCCA3V0_CODEC_2) U?#5.231(VCCA3V0_CODEC_1)
ARM_5V: Q?#9.2(D) U?#5.251(VCC_SYS_1) U?#5.252(VCC_SYS_2) U?#5.253(VCC_SYS_3) U?#5.254(VCC_SYS_4) U?#5.255(VCC_SYS_5) U?#5.256(VCC_SYS_6) U?#5.257(VCC_SYS_7) U?#5.258(VCC_SYS_8) U?#5.259(VCC_SYS_9) U?#5.260(VCC_SYS_10)
ARM_LAN_VCC: U?#5.226(VCC_3V3_S0_2) U?#5.227(VCC_3V3_S0) ; sheet U_EthernetRTL8211/LAN_3V3  [project net LAN_3V3]
ARM_USBDVDD: J?#7.1(VBUS) U?#4.1(OUT) USB?#2.1(VCC)
ARM_VDDIO: U?#5.224(VDDIO_WL_2) U?#5.225(VDDIO_WL_1)
DGND: C?#21.2 C?#22.2 C?#23.2 C?#24.2 D?#17.3(GND_1) D?#17.8(GND_2) D?#18.3(GND_1) D?#18.8(GND_2) D?#20.1(A) D?#21.3(GND_1) D?#21.8(GND_2) IC?#4.5(GND) IC?#4.7(EP) J?#7.4(GND) J?#7.7(GND_DRAIN) J?#7.S1(SHIELD) J?#7.S2(SHIELD) J?#7.S3(SHIELD) J?#7.S4(SHIELD) J?#8.6(VSS) J?#8.10(GND) Q?#8.2(S) Q?#12.2(E) Q?#13.2(E) Q?#14.2(S) R?#31.1 R?#33.1 R?#34.1 R?#39.1 R?#40.1 R?#44.2 U?#3.97(GND_11) U?#3.115(GND_13) U?#3.219(GND_25) U?#4.2(GND) U?#5.43(GND_4) U?#5.222(GND_26) U?#5.243(GND_28) U?#5.244(GND_27) U?#5.245(GND_30) U?#5.246(GND_29) U?#5.247(GND_32) U?#5.248(GND_31) U?#5.249(GND_34) U?#5.250(GND_33) U?#6.2(GND) U?#7.58(GND_7) U?#7.76(GND_8) U?#7.190(GND_21) U?#8.191(GND_19) U?#8.197(GND_20) U?#10.2(GND_2) U?#10.26(GND_3) U?#10.40(GND_5) U?#11.180(GND_16) U?#12.147(GND_14) U?#12.185(GND_18) U?#13.1(GND_1) U?#13.124(GND_10) U?#13.164(GND_12) USB?#2.4(GND) USB?#3.A1(GND) USB?#3.A12(GND) USB?#3.B1(GND) USB?#3.B12(GND)
GND: USB?#1.1(SH1) USB?#1.2(SH2) USB?#1.3(SH3) USB?#1.4(SH4) USB?#1.A1(GND) USB?#1.A12(GND) USB?#1.B1(GND) USB?#1.B12(GND)
TYPEC_USBDVDD: U?#6.1(OUT) USB?#3.A4(VBUS) USB?#3.A9(VBUS) USB?#3.B4(VBUS) USB?#3.B9(VBUS)
VDD_5V: USB?#1.A4(VBUS) USB?#1.A9(VBUS) USB?#1.B4(VBUS) USB?#1.B9(VBUS)
3VDVDD_SD: C?#21.1 C?#22.1 IC?#4.1(OUT) J?#8.4(VDD)
ARM_PWR_ON: R?#45.1 ; off-sheet ARM_PWR_ON
ARM_RST: R?#43.1 ; off-sheet ARM_RST
ARM_USB_DM: D?#18.5(D2-) D?#18.6(NC_1) U?#8.189(HOST0_DM) USB?#3.A7(Dn1) USB?#3.B7(Dn2)
ARM_USB_DP: D?#18.4(D2+) D?#18.7(NC_2) U?#8.187(HOST0_DP) USB?#3.A6(Dp1) USB?#3.B6(Dp2)
DEBUG_UART_RX: D?#19.2(K)
DEBUG_UART_TX: D?#20.2(K) U?#9.102(GPIO4_C4/UART2C_TX_U_3.0V)
GPIO0_B2_D_1.8V: U?#7.42(GPIO0_B2_D_1.8V) ; sheet U_WIFI_BT/WIFI_REG_ON_H
HDMI_CECINOUT: U?#3.95(GPIO4_C7/HDMI_CECINOUT/EDP_HOTPLUG_U_3.0V) ; sheet U_HDMI/HDMI_CEC  [project net HDMI_CEC]
HDMI_HPD: U?#3.89(HDMI_HPD) ; sheet U_HDMI/PORT_HPD
HDMI_I2C3_SCL: U?#3.93(GPIO4_C1/I2C3_SCL/UART2B_TX_U_3.0V) ; sheet U_HDMI/I2C_SCL_HDMI
HDMI_I2C3_SDA: U?#3.91(GPIO4_C0/I2C3_SDA/UART2B_RX_U_3.0V) ; sheet U_HDMI/I2C_SDA_HDMI
HDMI_TCN: U?#3.99(HDMI_TCN) ; sheet U_HDMI/HDMI_TXC_N
HDMI_TCP: U?#3.101(HDMI_TCP) ; sheet U_HDMI/HDMI_TXC_P
HDMI_TX0N: U?#3.103(HDMI_TX0N) ; sheet U_HDMI/HDMI_TX0_N  [project net HDMI_TX0_N]
HDMI_TX0P: U?#3.105(HDMI_TX0P) ; sheet U_HDMI/HDMI_TX0_P  [project net HDMI_TX0_P]
HDMI_TX1N: U?#3.107(HDMI_TX1N) ; sheet U_HDMI/HDMI_TX1_N  [project net HDMI_TX1_N]
HDMI_TX1P: U?#3.109(HDMI_TX1P) ; sheet U_HDMI/HDMI_TX1_P  [project net HDMI_TX1_P]
HDMI_TX2N: U?#3.111(HDMI_TX2N) ; sheet U_HDMI/HDMI_TX2_N  [project net HDMI_TX2_N]
HDMI_TX2P: U?#3.113(HDMI_TX2P) ; sheet U_HDMI/HDMI_TX2_P  [project net HDMI_TX2_P]
HUB_USB_DM: D?#21.5(D2-) D?#21.6(NC_1) U?#8.195(HOST1_DM)
HUB_USB_DP: D?#21.4(D2+) D?#21.7(NC_2) U?#8.193(HOST1_DP)
I2C1_SCL: U?#10.24(GPIO4_A2/I2C1_SCL_U_1.8V) ; sheet U_CODEC/I2C_SCL_AUDIO
I2C1_SDA: U?#10.22(GPIO4_A1/I2C1_SDA_U_1.8V) ; sheet U_CODEC/I2C_SDA_AUDIO
I2S0_LRCK_RX: U?#10.6(GPIO3_D1/I2S0_LRCK_RX_D_1.8V)
I2S0_LRCK_TX: U?#10.8(GPIO3_D2/I2S0_LRCK_TX_D_1.8V)
I2S0_SCLK: U?#10.4(GPIO3_D0/I2S0_SCLK_D_1.8V)
I2S0_SDI0: U?#10.10(GPIO3_D3/I2S0_SDI0_D_1.8V)
I2S0_SDI1SDO3: U?#10.14(GPIO3_D4/I2S0_SDI1SDO3_D_1.8V)
I2S0_SDI2SDO2: U?#10.16(GPIO3_D5/I2S0_SDI2SDO2_D_1.8V)
I2S0_SDI3SDO1: U?#10.18(GPIO3_D6/I2S0_SDI3SDO1_D_1.8V)
I2S0_SDO0: U?#10.12(GPIO3_D7/I2S0_SDO0_D_1.8V)
I2S1_LRCK_RX: U?#10.32(GPIO4_A4/I2S1_LRCK_RX_D_1.8V) ; sheet U_CODEC/I2S0_LRCK_RX  [project net I2S0_LRCK_RX]
I2S1_LRCK_TX: U?#10.34(GPIO4_A5/I2S1_LRCK_TX_D_1.8V) ; sheet U_CODEC/I2S0_LRCK_TX  [project net I2S0_LRCK_TX]
I2S1_SCLK: U?#10.30(GPIO4_A3/I2S1_SCLK_D_1.8V) ; sheet U_CODEC/I2S0_SCLK  [project net I2S0_SCLK]
I2S1_SDI0: U?#10.36(GPIO4_A6/I2S1_SDI0_D_1.8V) ; sheet U_CODEC/I2S0_SDI0  [project net I2S0_SDI0]
I2S1_SDO0: U?#10.38(GPIO4_A7/I2S1_SDO0_D_1.8V) ; sheet U_CODEC/I2S0_SDO0  [project net I2S0_SDO0]
I2S_CLK: U?#10.20(GPIO4_A0/I2S_CLK_D_1.8V) ; sheet U_CODEC/I2S_CLK
IIC_SCL: U?#13.13(GPIO1_B4/I2C4_SCL_U_3.0V)
IIC_SDA: U?#13.15(GPIO1_B3/I2C4_SDA_U_3.0V)
LED_Blink: R?#42.1 U?#13.5(GPIO0_B5/TCPD_VBUS_FDIS/TCPD_VBUS_SOURCE3_D_1.8V)
LED_EN: R?#41.1 U?#13.3(GPIO2_D3/SDIO0_PWREN_D_1.8V)
MAC_CLK: U?#7.192(GPIO3_B3/MAC_CLK/I2C5_SCL_U_3.3V) ; sheet U_EthernetRTL8211/MAC_CLK
MAC_MDC: U?#7.184(GPIO3_B0/MAC_MDC/SPI0_CSN1_U_3.3V) ; sheet U_EthernetRTL8211/MDC
MAC_MDIO: U?#7.182(GPIO3_B5/MAC_MDIO/UART1_TX_U_3.3V) ; sheet U_EthernetRTL8211/MDIO
MAC_RXCLK: U?#7.188(GPIO3_B6/MAC_RXCLK/UART3_RX_U_3.3V) ; sheet U_EthernetRTL8211/RXC
MAC_RXD0: U?#7.198(GPIO3_A6/MAC_RXD0/SPI0_CLK_U_3.3V) ; sheet U_EthernetRTL8211/RX0
MAC_RXD1: U?#7.194(GPIO3_A7/MAC_RXD1/SPI0_CSN0_U_3.3V) ; sheet U_EthernetRTL8211/RX1
MAC_RXD2: U?#7.200(GPIO3_A2/MAC_RXD2/SPI4_CLK_U_3.3V) ; sheet U_EthernetRTL8211/RX2
MAC_RXD3: U?#7.196(GPIO3_A3/MAC_RXD3/SPI4_CSN0_U_3.3V) ; sheet U_EthernetRTL8211/RX3
MAC_RXDV: U?#7.202(GPIO3_B1/MAC_RXDV_D_3.3V) ; sheet U_EthernetRTL8211/RXCTL
MAC_TXCLK: U?#7.186(GPIO3_C1/MAC_TXCLK/UART3_RTSN_U_3.3V) ; sheet U_EthernetRTL8211/TXC
MAC_TXD0: U?#7.204(GPIO3_A4/MAC_TXD0/SPI0_RXD_D_3.3V) ; sheet U_EthernetRTL8211/TX0
MAC_TXD1: U?#7.210(GPIO3_A5/MAC_TXD1/SPI0_TXD_D_3.3V) ; sheet U_EthernetRTL8211/TX1
MAC_TXD2: U?#7.206(GPIO3_A0/MAC_TXD2/SPI4_RXD_D_3.3V) ; sheet U_EthernetRTL8211/TX2
MAC_TXD3: U?#7.208(GPIO3_A1/MAC_TXD3/SPI4_TXD_D_3.3V) ; sheet U_EthernetRTL8211/TX3
MAC_TXEN: U?#7.212(GPIO3_B4/MAC_TXEN/UART1_RX_U_3.3V) ; sheet U_EthernetRTL8211/TXCTL
PCIE_CLKREQ: U?#13.160(GPIO4_D0/PCIE_CLKREQNB_U_3.0V)
PCIE_RCLK_100M_N: U?#12.181(PCIE_RCLK_100M_N)
PCIE_RCLK_100M_P: U?#12.183(PCIE_RCLK_100M_P)
PCIE_RX0_N: U?#12.175(PCIE_RX0_N)
PCIE_RX0_P: U?#12.173(PCIE_RX0_P)
PCIE_RX1_N: U?#12.167(PCIE_RX1_N)
PCIE_RX1_P: U?#12.165(PCIE_RX1_P)
PCIE_RX2_N: U?#12.159(PCIE_RX2_N)
PCIE_RX2_P: U?#12.157(PCIE_RX2_P)
PCIE_RX3_N: U?#12.151(PCIE_RX3_N)
PCIE_RX3_P: U?#12.149(PCIE_RX3_P)
PCIE_TX0_N: U?#12.179(PCIE_TX0_N)
PCIE_TX0_P: U?#12.177(PCIE_TX0_P)
PCIE_TX1_N: U?#12.171(PCIE_TX1_N)
PCIE_TX1_P: U?#12.169(PCIE_TX1_P)
PCIE_TX2_N: U?#12.163(PCIE_TX2_N)
PCIE_TX2_P: U?#12.161(PCIE_TX2_P)
PCIE_TX3_N: U?#12.155(PCIE_TX3_N)
PCIE_TX3_P: U?#12.153(PCIE_TX3_P)
PHY_RST: U?#13.216(GPIO3_B7/MAC_CRS/CIF_CLKOUTB/UART3_TX_U_3.3V) ; sheet U_EthernetRTL8211/PHYRST
PMIC_EN: D?#25.1(A) Q?#8.1(G) R?#31.2 U?#13.220(PMIC_EXT_EN)
PMUIO2_VOLSEL: U?#7.62(GPIO0_B1/PMUIO2_VOLSEL_D_1.8V) ; sheet U_WIFI_BT/BT_REG_ON_H
RESET: D?#24.1(A) U?#13.218(RESET_KEY)
RTC_CLKO_WIFI: U?#7.60(RTC_CLKO_WIFI) ; sheet U_WIFI_BT/RTC_CLKO_WIFI
SD_PWR: IC?#4.4(EN) R?#36.2 U?#13.90(GPIO1_C6/TCPD_VBUS_SOURCE0_D_3.0V)
SDIO0_BKPWR: U?#7.78(GPIO2_D4/SDIO0_BKPWR_D_1.8V)
SDIO0_CLKOUT: U?#7.52(GPIO2_D1/SDIO0_CLKOUT/TEST_CLKOUT1_U_1.8V) ; sheet U_WIFI_BT/SDIO0_CLK
SDIO0_CMD: U?#7.50(GPIO2_D0/SDIO0_CMD_U_1.8V) ; sheet U_WIFI_BT/SDIO0_CMD
SDIO0_D0: U?#7.54(GPIO2_C4/SDIO0_D0/SPI5_RXD_U_1.8V) ; sheet U_WIFI_BT/SDIO0_D0
SDIO0_D1: U?#7.56(GPIO2_C5/SDIO0_D1/SPI5_TXD_U_1.8V) ; sheet U_WIFI_BT/SDIO0_D1
SDIO0_D2: U?#7.46(GPIO2_C6/SDIO0_D2/SPI5_CLK_U_1.8V) ; sheet U_WIFI_BT/SDIO0_D2
SDIO0_D3: U?#7.48(GPIO2_C7/SDIO0_D3/SPI5_CSN0_U_1.8V) ; sheet U_WIFI_BT/SDIO0_D3
SDIO0_DETN: U?#7.72(GPIO2_D2/SDIO0_DETN/PCIE_CLKREQN_U_1.8V) ; sheet U_WIFI_BT/BT_WAKE_L
SDIO0_INTN: U?#7.74(GPIO0_A4/SDIO0_INTN_D_1.8V) ; sheet U_WIFI_BT/BT_HOST_WAKE_L
SDIO0_WRPT: U?#7.44(GPIO0_A3/SDIO0_WRPT_D_1.8V) ; sheet U_WIFI_BT/WIFI_HOST_WAKE_L
SDMMC0_CLKOUT: J?#8.5(CLK) U?#11.176(GPIO4_B4/SDMMC0_CLKOUT/MUCJTAG_TCK_D_3.0V)
SDMMC0_CMD: J?#8.3(CMD) U?#11.172(GPIO4_B5/SDMMC0_CMD/MCUJTAG_TMS_U_3.0V)
SDMMC0_D0: U?#11.168(GPIO4_B0/SDMMC0_D0/UART2A_RX_U_3.0V)
SDMMC0_D1: J?#8.7(DATA0) U?#11.166(GPIO4_B1/SDMMC0_D1/UART2A_TX_U_3.0V)
SDMMC0_D2: J?#8.8(DATA1) U?#11.170(GPIO4_B2/SDMMC0_D2/APJTAG_TCK_U_3.0V)
SDMMC0_D3: J?#8.1(DATA2) U?#11.174(GPIO4_B3/SDMMC0_D3/APJTAG_TMS_U_3.0V)
SDMMC0_D4: J?#8.2(CD/DATA3)
SDMMC0_DET: J?#8.9(K) U?#11.178(GPIO0_A7/SDMMC0_DET_U_1.8V)
TYPEC1_DM: D?#18.2(D1-) D?#18.9(NC_3) U?#8.146(TYPEC1_DM) USB?#2.2(D-)
TYPEC1_DP: D?#18.1(D1+) D?#18.10(NC_4) U?#8.148(TYPEC1_DP) USB?#2.3(D+)
TYPEC_5V_ENABLE: U?#6.4(EN) U?#13.9(GPIO1_A3/ISP0_FLASHTRIGOUT/ISP1_FLASHTRIGOUT_D_3.0V)
UART0_CTSN: U?#7.68(GPIO2_C2/UART0_CTSN_U_1.8V) ; sheet U_WIFI_BT/UART0_CTS
UART0_RTSN: U?#7.70(GPIO2_C3/UART0_RTSN_U_1.8V) ; sheet U_WIFI_BT/UART0_RTS
UART0_RX: U?#7.64(GPIO2_C0/UART0_RX_U_1.8V) ; sheet U_WIFI_BT/UART0_RXD
UART0_TX: U?#7.66(GPIO2_C1/UART0_TX_U_1.8V) ; sheet U_WIFI_BT/UART0_TXD
USB3_DM: D?#21.1(D1+) D?#21.10(NC_4) J?#7.2(D-) U?#8.135(TYPEC0_DM)
USB3_DP: D?#21.2(D1-) D?#21.9(NC_3) J?#7.3(D+) U?#8.133(TYPEC0_DP)
USB3_SSRX_N: J?#7.6(STDA_SSRX+) U?#8.127(TYPEC0_RX1P)
USB3_SSRX_P: J?#7.5(STDA_SSRX-) U?#8.125(TYPEC0_RX1M)
USB3_SSRXN_: D?#17.1(D1+) D?#17.10(NC_4)
USB3_SSRXP_: D?#17.2(D1-) D?#17.9(NC_3)
USB3_SSTX_N: C?#19.1 U?#8.131(TYPEC0_TX1M)
USB3_SSTX_P: C?#20.1 U?#8.129(TYPEC0_TX1P)
USB3_SSTXN_: D?#17.4(D2+) D?#17.7(NC_2)
USB3_SSTXP_: D?#17.5(D2-) D?#17.6(NC_1)
USB-PWR-DM: USB?#1.A7(D-) USB?#1.B7(D-)
USB-PWR-DP: USB?#1.A6(D+) USB?#1.B6(D+)
USB_5V_ENABLE: U?#4.4(EN) U?#13.7(GPIO1_A0/ISP0_SHUTTER_EN/ISP1_SHUTTER_EN/TCPD_VBUS_SINK_EN_D_3.0V)
NetC?#19_2: C?#19.2 J?#7.9(STDA_SSTX+)
NetC?#20_2: C?#20.2 J?#7.8(STDA_SSTX-)
NetD?#19_1: D?#19.1(A) R?#35.1 U?#9.100(GPIO4_C3/UART2C_RX_U_3.0V)
NetD?#22_1: D?#22.1(A) Q?#10.3(D)
NetD?#22_2: D?#22.2(K) R?#39.2
NetD?#23_1: D?#23.1(A) Q?#11.3(D)
NetD?#23_2: D?#23.2(K) R?#40.2
NetD?#24_2: D?#24.2(K) D?#25.2(K) Q?#14.3(D)
NetQ?#8_3: Q?#8.3(D) Q?#9.1(G) R?#32.2
NetQ?#10_1: Q?#10.1(G) R?#37.2
NetQ?#11_1: Q?#11.1(G) R?#38.1
NetQ?#12_1: Q?#12.1(B) R?#41.2
NetQ?#12_3: Q?#12.3(C) R?#37.1
NetQ?#13_1: Q?#13.1(B) R?#42.2
NetQ?#13_3: Q?#13.3(C) R?#38.2
NetQ?#14_1: Q?#14.1(G) R?#43.2 R?#44.1
NetR?#33_2: R?#33.2 U?#4.3(ISET)
NetR?#34_2: R?#34.2 U?#6.3(ISET)
NetR?#45_2: R?#45.2 U?#13.221(POWER_ON)

Not connected (* = marked no-connect by the designer): IC?#4 2(NC)* 3(PG)*; U?#3 94(GPIO4_C2/PWM0/VOP0_PWM/VOP1_PWM_D_3.0V)* 199(EDP_TX3N)* 201(EDP_TX3P)* 203(EDP_TX2N)* 205(EDP_TX2P)* 207(EDP_TX1N)* 209(EDP_TX1P)* 211(EDP_TX0N)* 213(EDP_TX0P)* 215(EDP_AUXN)* 217(EDP_AUXP)*; U?#5 236(NC_1)* 237(NC_2)* 238(NC_3)* 239(NC_4)* 240(NC_5)* 241(NC_6)* 242(NC_7)*; U?#7 214(GPIO3_B2/MAC_RXER/I2C5_SDA_U_3.3V)*; U?#8 117(TYPEC0_AUXP_PD_PU)* 119(TYPEC0_AUXM_PU_PD)* 121(TYPEC0_AUXM)* 123(TYPEC0_AUXP)* 137(TYPEC0_RX2M)* 139(TYPEC0_RX2P)* 141(TYPEC0_TX2P)* 143(TYPEC0_TX2M)* 145(TYPEC0_U2VBUSDET)*; U?#9 29(GPIO2_B4/SPI2_CSN0_U_3.0V)* 31(GPIO2_B2/SPI2_TXD/CIF_CLKIN/I2C6_SCL_U_3.0V)* 33(GPIO2_B1/SPI2_RXD/CIF_HREF/I2C6_SDA_U_3.0V)* 35(GPIO2_B3/SPI2_CLK/VOP_DEN/CIF_CLKOUTA_U_3.0V)* 82(GPIO1_B1/SPI1_CLK/PMCU_JTAG_TCK_U_3.0V)* 84(GPIO1_B2/SPI1_CSN0/PMCU_JTAG_TMS_U_3.0V)* 86(GPIO1_B0/SPI1_TXD/UART4_TX_U_3.0V)* 88(GPIO1_A7/SPI1_RXD/UART4_RX_U_3.0V)* ?1*; U?#10 28(GPIO3_C0/MAC_COL/UART3_CTSN/SPDIF_TX_U_3.3V)*; U?#13 11(GPIO1_B5_D_3.0V)* 17(GPIO1_A4/ISP0_PRELIGHT_TRIG/ISP1_PRELIGHT_TRIG_D_3.0V)* 19(GPIO1_A1/ISP0_SHUTTER_TRIG/ISP1_SHUTTER_TRIG/TCPD_CC0_VCONN_EN_D_3.0V)* 21(GPIO0_B4/TCPD_VBUS_BDIS_D_1.8V)* 23(GPIO4_C5/SPDIF_TX_D_3.0V)* 25(GPIO0_B0/SDMMC0_WRPT/TEST_CLKOUT2_U_1.8V)* 27(GPIO0_A1/DDRIO_PWROFF/TCPD_CCDB_EN_U_1.8V)* 37(GPIO1_C7/TCPD_VBUS_SOURCE1_D_3.0V)* 39(GPIO1_C4/I2C8_SDA_U_3.0V)* 41(GPIO1_C1/SPI3_CLK_D_3.0V)* 80(GPIO4_D4_D_3.0V)* 92(GPIO1_D0/TCPD_VBUS_SOURCE2_D_3.0V)* 98(GPIO0_A6/PWM3A_IR_D_1.8V)* 108(GPIO2_A7/VOP_D7/CIF_D7/I2C7_SDA_U_3.0V)* 110(GPIO2_B0/VOP_CLK/CIF_VSYNC/I2C7_SCL_U_3.0V)* 112(GPIO2_A2/VOP_D2/CIF_D2_D_3.0V)* 114(GPIO2_A3/VOP_D3/CIF_D3_D_3.0V)* 116(GPIO1_A2/ISP0_FLASHTRIGIN/ISP1_FLASHTRIGIN/TCPD_CC1_VCONN_EN_D_3.0V)* 118(GPIO4_D5_D_3.0V)* 120(GPIO4_D6_D_3.0V)* 122(GPIO4_D3_D_3.0)* 150(ADC_IN0)* 152(ADC_IN1)* 154(ADC_IN2)* 156(ADC_IN3)* 158(GPIO4_D2_D_3.0V)* 162(GPIO4_D1/DP_HOTPLUG_D_3.0V)*; USB?#1 A2(TX1+) A3(TX1-) A5(CC1) A8(SBU1) A10(RX2-) A11(RX2+) B2(TX2+) B3(TX2-) B5(CC2) B8(SBU2) B10(RX1-) B11(RX1+); USB?#3 A2(SSTXp1)* A3(SSTXn1)* A5(CC1)* A8(SBU1)* A10(SSRXn2)* A11(SSRXp2)* B2(SSTXp2)* B3(SSTXn2)* B5(CC2)* B8(SBU2)* B10(SSRXn1)* B11(SSRXp1)*

### Layout directives
differential pair: USB3_DM, USB3_DP, USB3_SSRX_N, USB3_SSRX_P, USB3_SSTX_N, USB3_SSTX_P

### Library data of the parts
C?#19-C?#24 = Cap: Capacitor; Published: 8-Jun-2000; LatestRevisionDate: 17-Jul-2002; LatestRevisionNote: Re-released for DXP Platform.; PackageReference: RAD-0.3; Publisher: Altium Limited
  C?#19 C?#20 C?#22 C?#24: Value: 104
  C?#21 C?#23: Value: 475
D?#17 D?#18 D?#21 = TPD4E05U06DQAR: Diode; Manufacturer_Name: Texas Instruments; Datasheet Link: http://www.ti.com/lit/gpn/tpd4e05u06; Manufacturer_Part_Number: TPD4E05U06DQAR; Mouser Part Number: 595-TPD4E05U06DQAR; Mouser Price/Stock: https://www.mouser.co.uk/ProductDetail/Texas-Instruments/TPD4E05U06DQAR?qs=%2FCrDlo5IrVPi4woOvWz0qA%3D%3D; Arrow Part Number: TPD4E05U06DQAR; Arrow Price/Stock: https://www.arrow.com/en/products/tpd4e05u06dqar/texas-instruments?region=nac
D?#19 D?#20 D?#24 D?#25 = SS14: 肖特基二极管; 属性: 40V/1A; BOM名称: 肖特基二极管; 封装库来自淘宝 ID：黄晶宝石: https://shop463601444.taobao.com
D?#22 D?#23 = LED: 发光二极管; 技术支持，联系售后: https://shop463601444.taobao.com
IC?#4 = LP5912-3.0DRVR: Integrated Circuit; Manufacturer_Name: Texas Instruments; Datasheet Link: http://www.ti.com/lit/gpn/lp5912; Height: 0.8mm; Manufacturer_Part_Number: LP5912-3.0DRVR; Mouser Part Number: 595-LP5912-3.0DRVR; Mouser Price/Stock: https://www.mouser.co.uk/ProductDetail/Texas-Instruments/LP5912-3.0DRVR?qs=yBt6ao%2FxsTzuXuKE9NcTCg%3D%3D; Arrow Part Number: LP5912-3.0DRVR; Arrow Price/Stock: https://www.arrow.com/en/products/lp5912-3.0drvr/texas-instruments
J?#7 = 0483930003: Usb Rec 4p Ra Type a 15au; MF: {'manufacturer': u'Molex'}; Package: None; Price: None; Value: *; MP: 0483930003; Availability: Unavailable
J?#8 = TF_Card: TF卡座; BOM名称: TF卡座; 学习资源: https://shop463601444.taobao.com
Q?#8 Q?#10 Q?#11 Q?#14 = SI2302: N沟道场效应管; 技术支持，联系售后: 封装库来自淘宝 ID：黄晶宝石; BOM名称: N沟道场效应管; 学习资源: https://shop463601444.taobao.com
Q?#9 = IRF4905: P沟场效应管; BOM名称: P沟场效应管
Q?#12 Q?#13 = 8050-SMD: 高频放大-NPN型; 版权归属: 封装库来自淘宝 ID：黄晶宝石; 属性: 40V 1.5A 1W 100MHZ; BOM名称: 高频放大-NPN型; 联系售后: https://shop463601444.taobao.com
R?#31-R?#45 = 0805 电阻: 贴片电阻 0805 电阻; ComponentLink1Description: 供应商链接; ComponentLink1URL: http://www.szlcsc.com/product/details_18165.html; Package: 0805; Supplier: LC; SuppliersPartNumber: C17477
U?#3 U?#5 U?#7-U?#13 = RK3399-JD4-DDR4
U?#4 U?#6 = SY6280AAC: MF: {'manufacturer': u'Silergy'}; Package: None; Price: None; Value: *; MP: SY6280AAC; Availability: Unavailable
USB?#1 = USB-Type-C-TOP
USB?#2 = USB-A/P: USB-A型公接口; 版权归属: 封装库来自淘宝卖家 ID：黄晶宝石; BOM名称: USB-A型公接口; 学习资源: https://shop463601444.taobao.com
USB?#3 = USB-C/S: USB-C型母接口; 学习资源: 封装库来自淘宝卖家 ID：黄晶宝石; BOM名称: USB-C型母接口; 封装库来自淘宝 ID：黄晶宝石: https://shop463601444.taobao.com